# EAGLE board DMFX-1 v1.0 (EAGLE 6.3), part 1 of 3
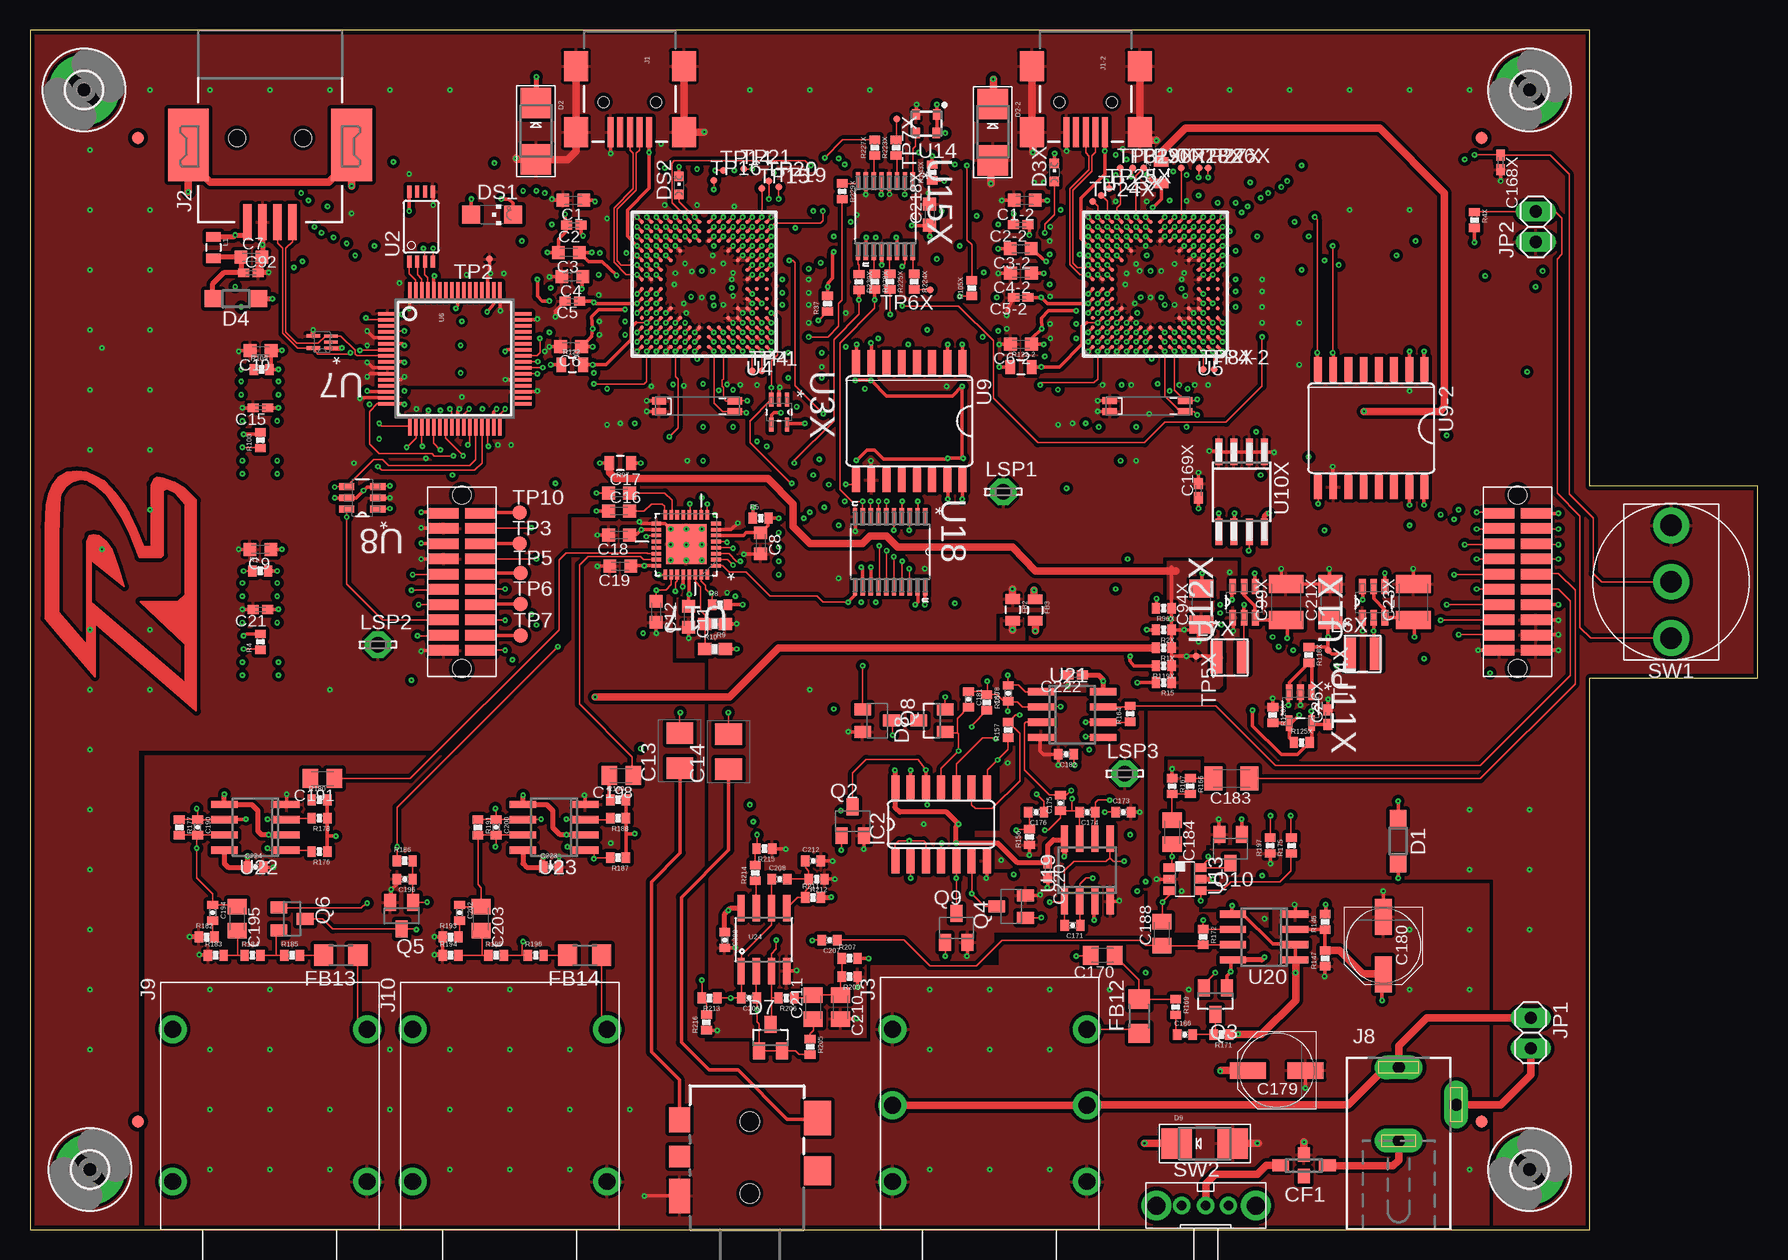
[diagram p12: board, top side]
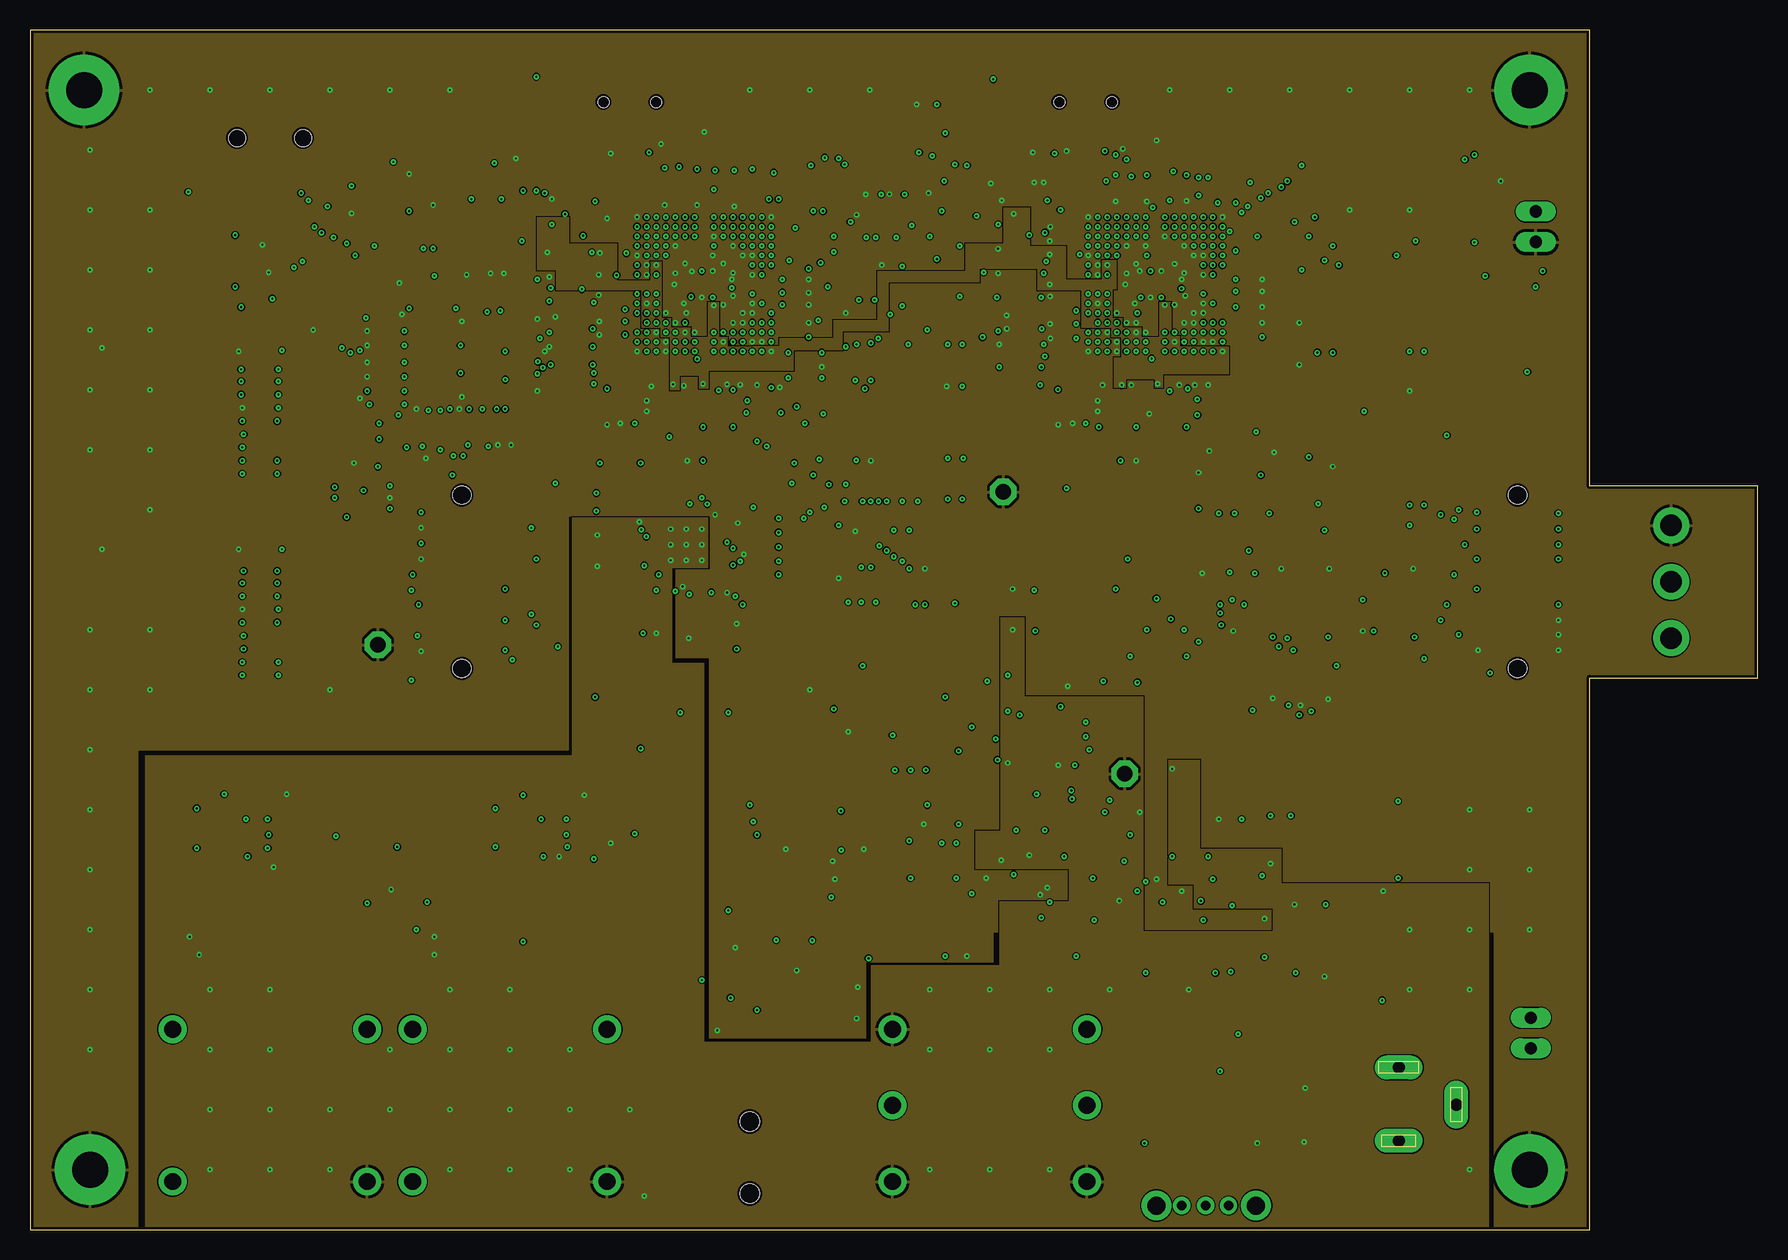
[diagram p13: board, inner layer Route2]
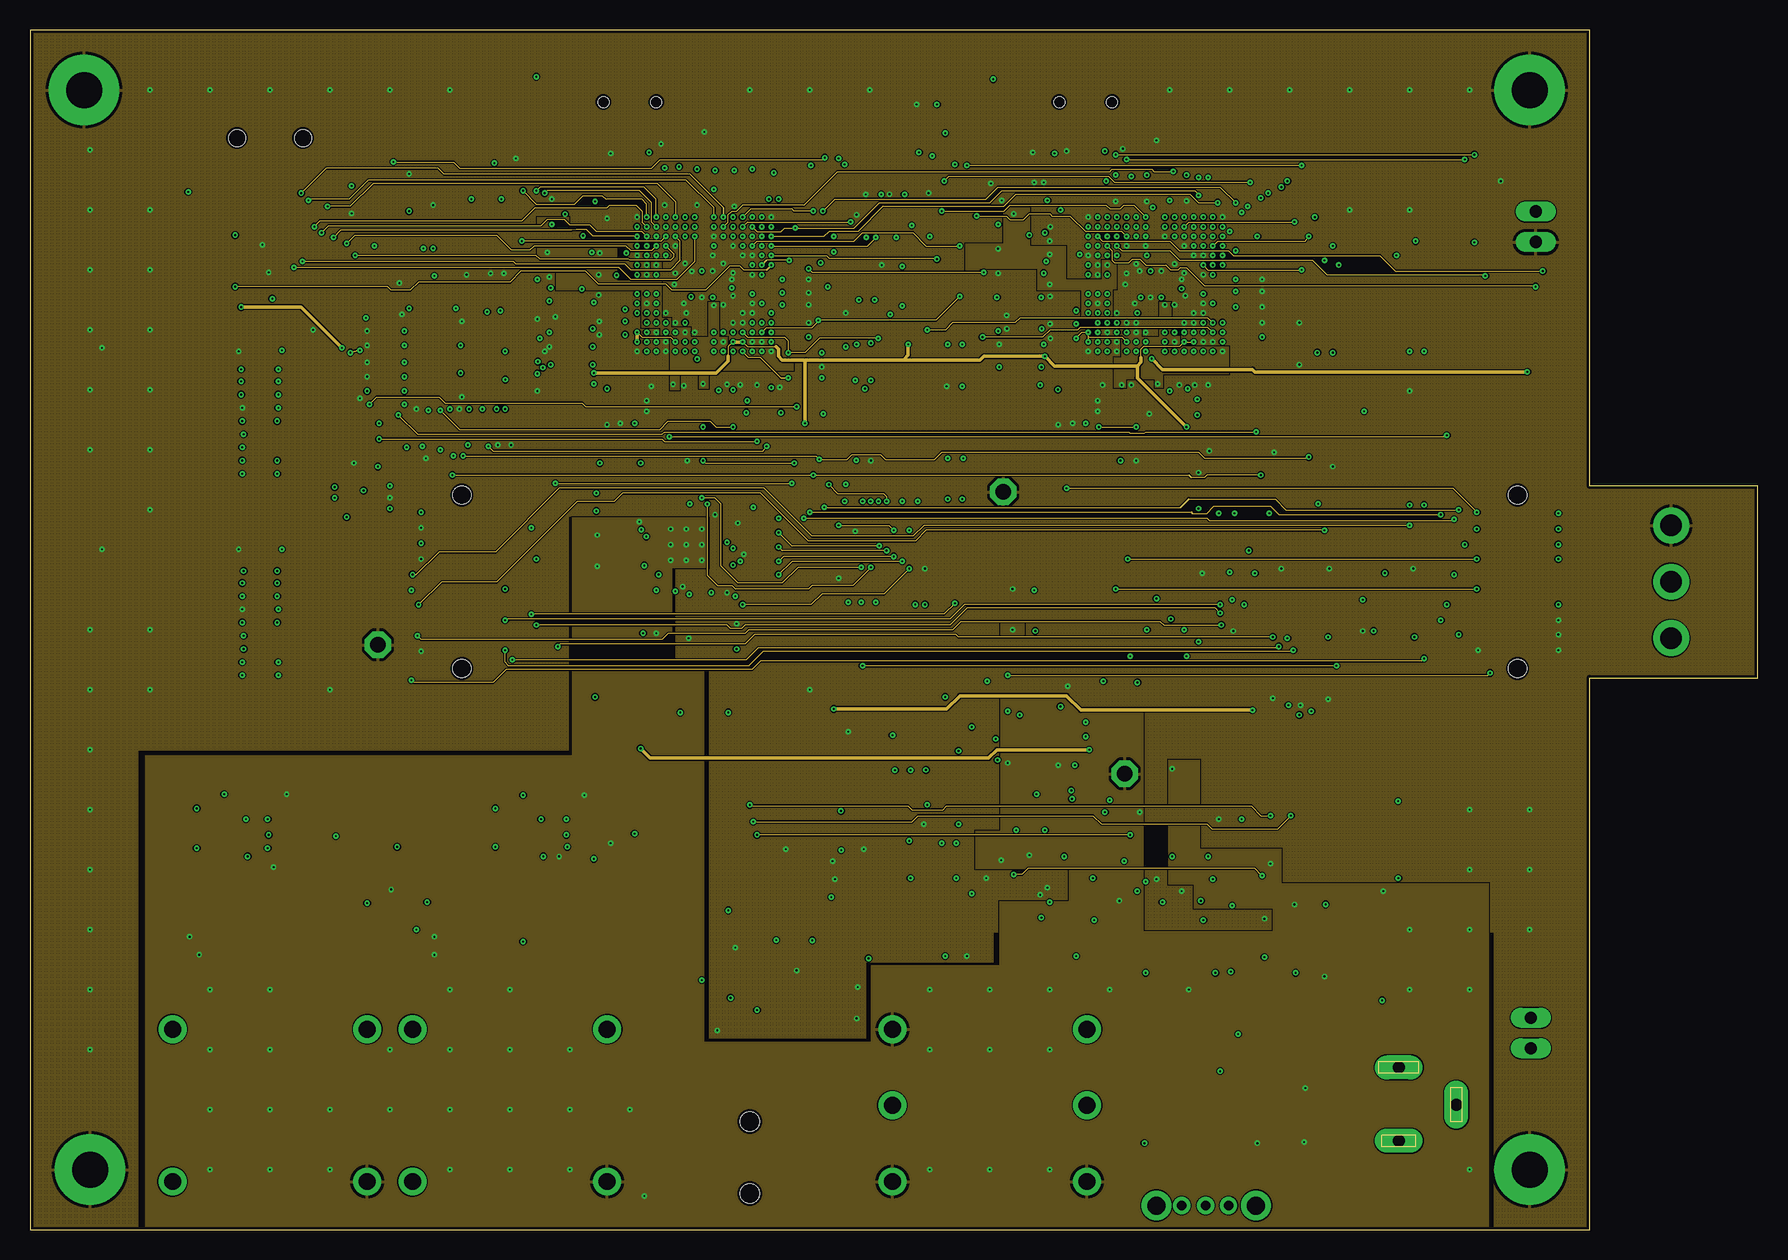
[diagram p14: board, inner layer Route3]
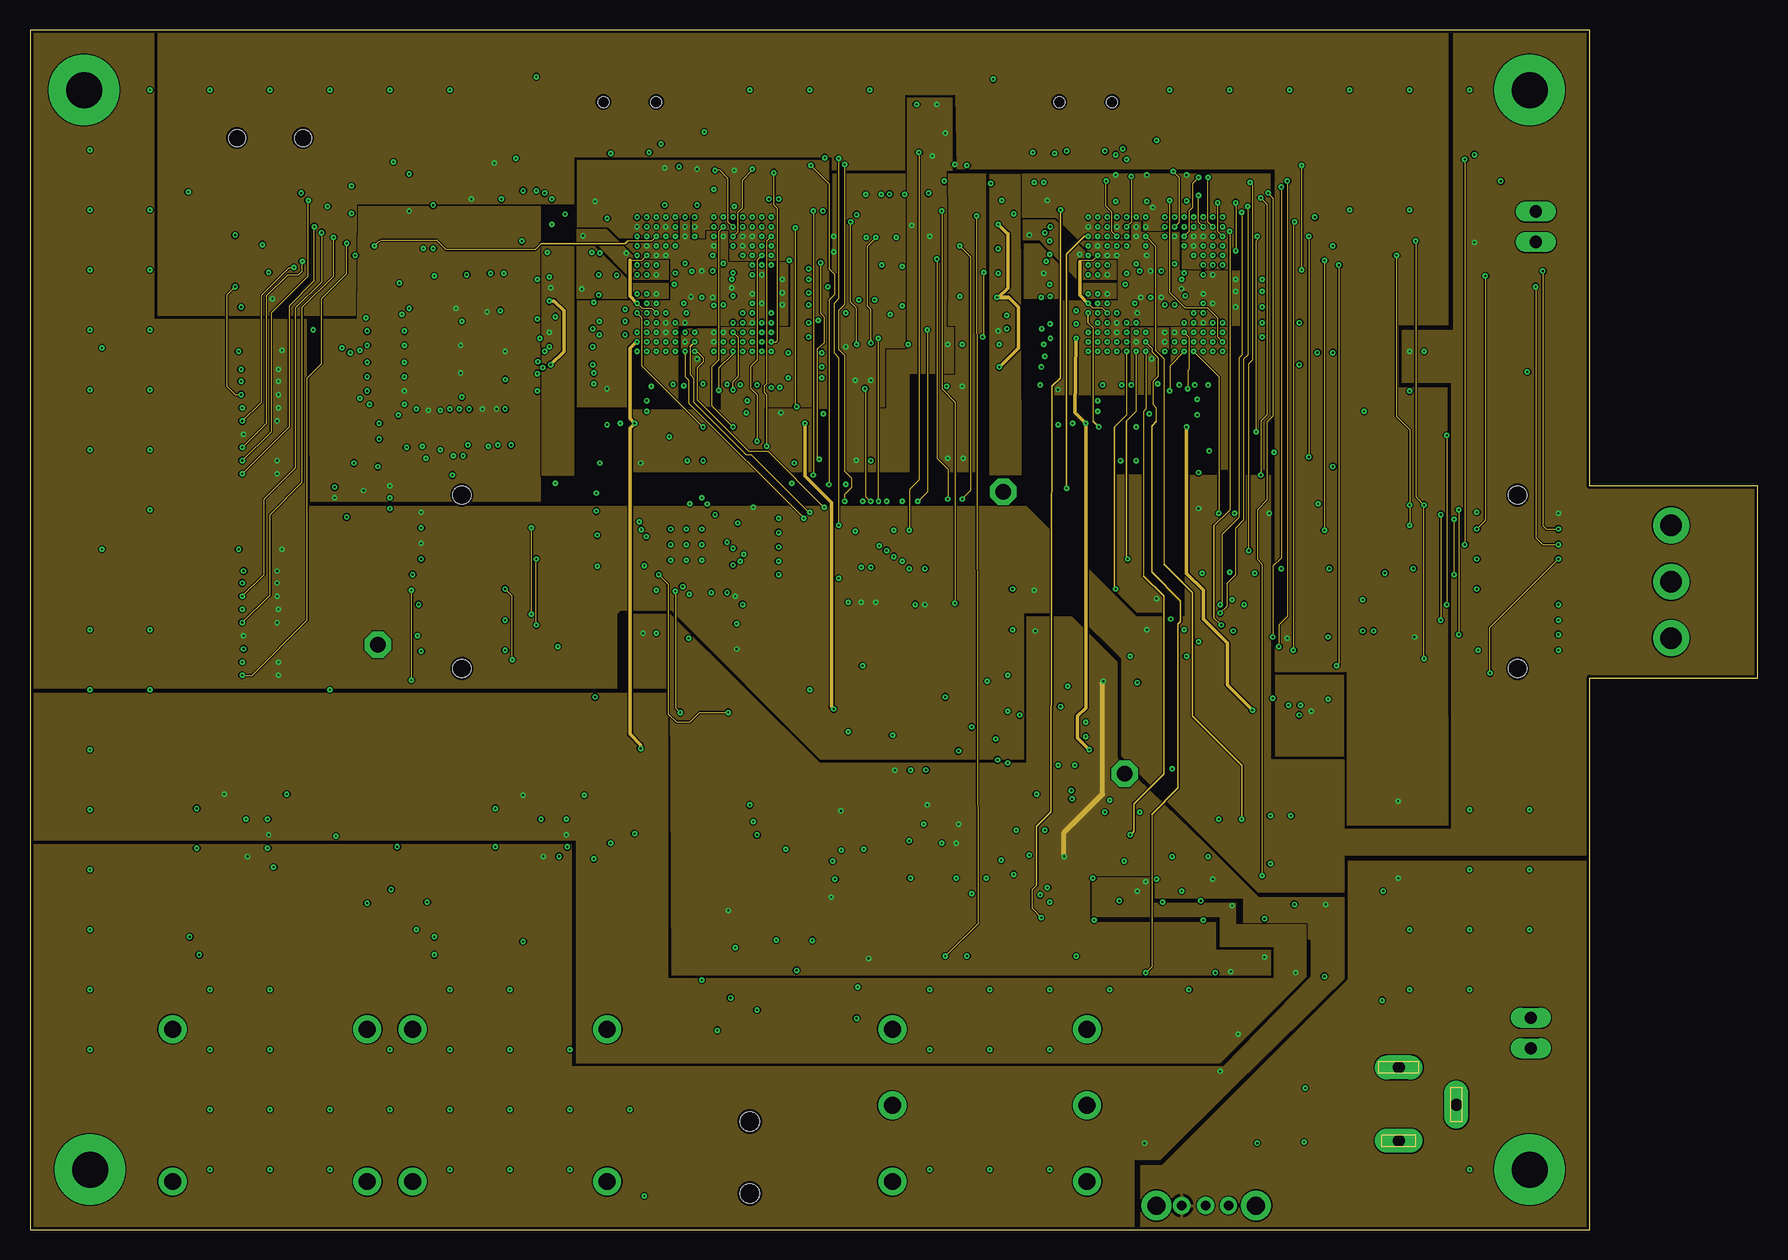
[diagram p15: board, inner layer Route4]
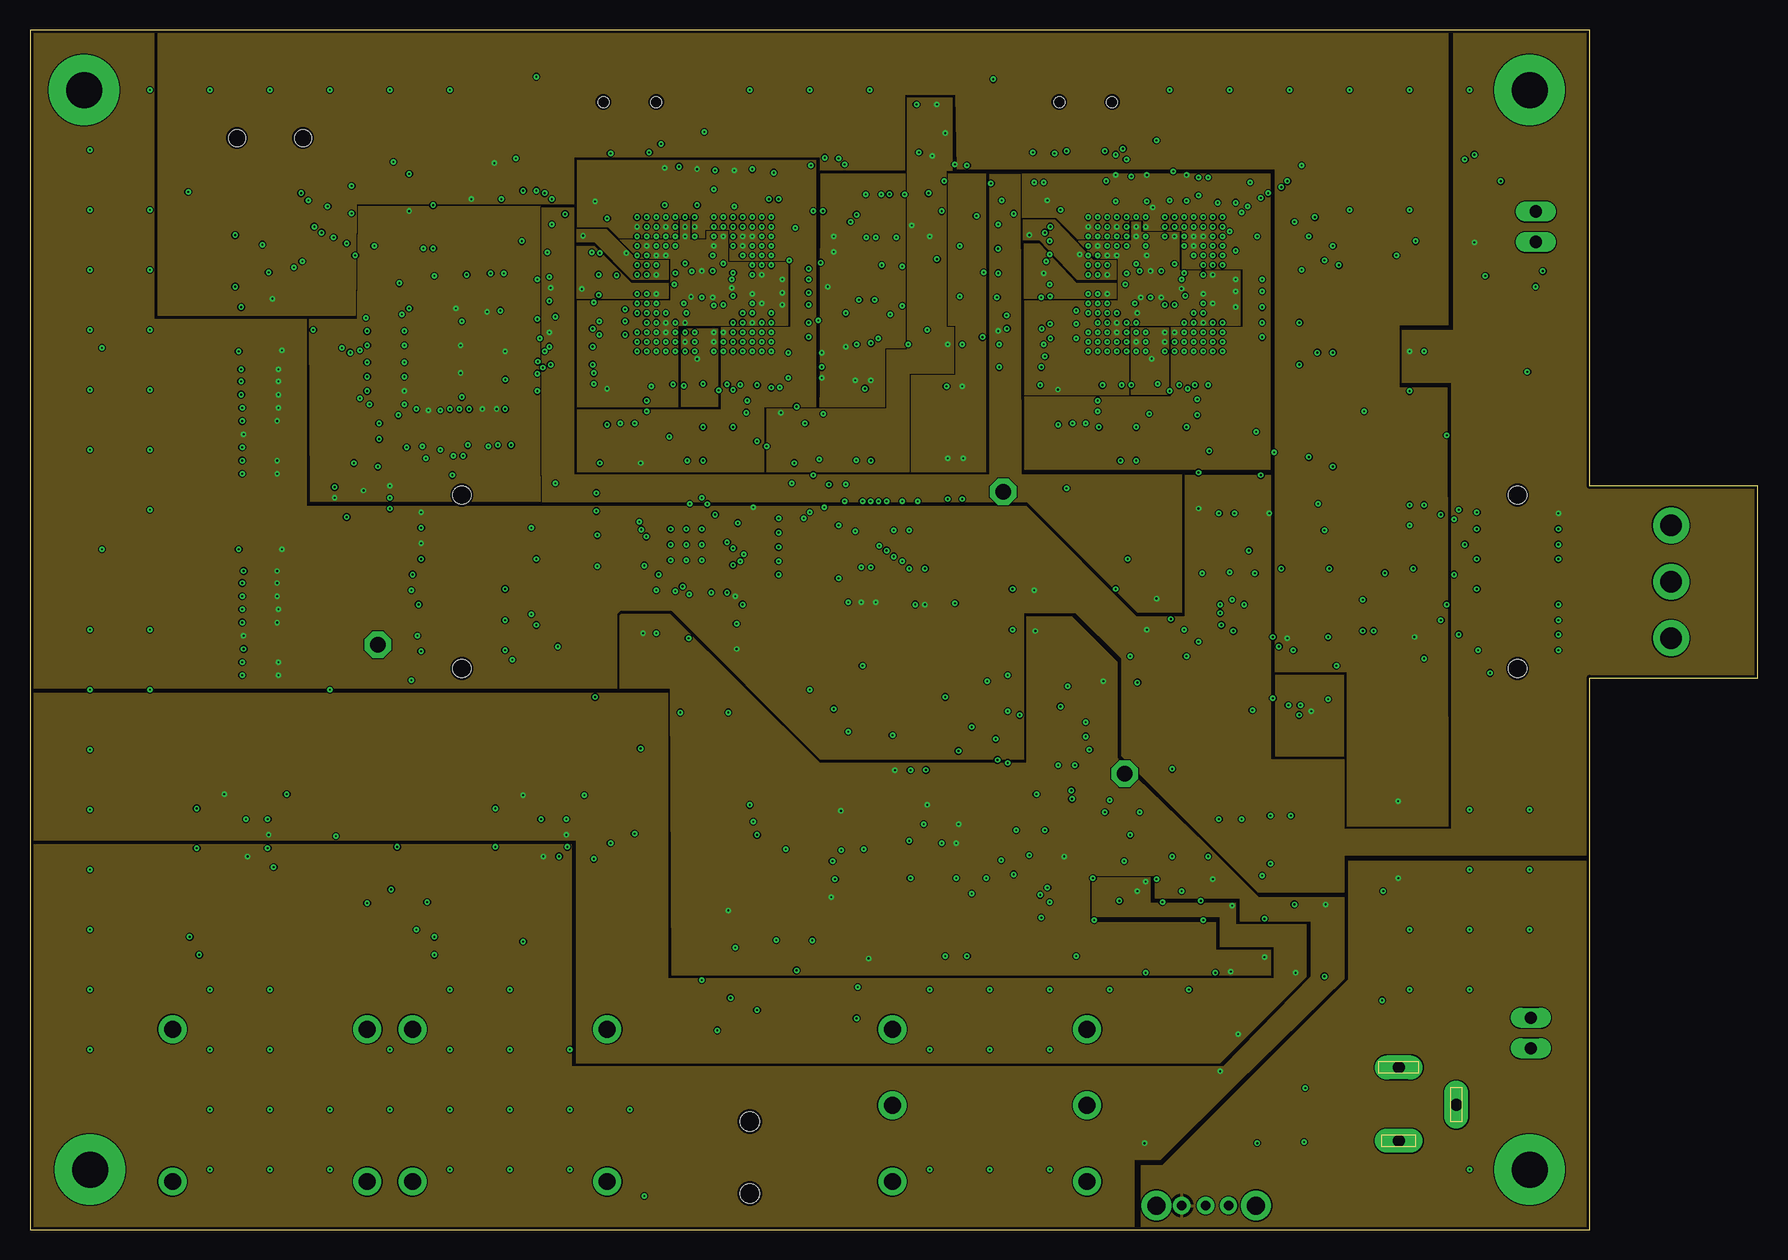
[diagram p16: board, inner layer Route5]
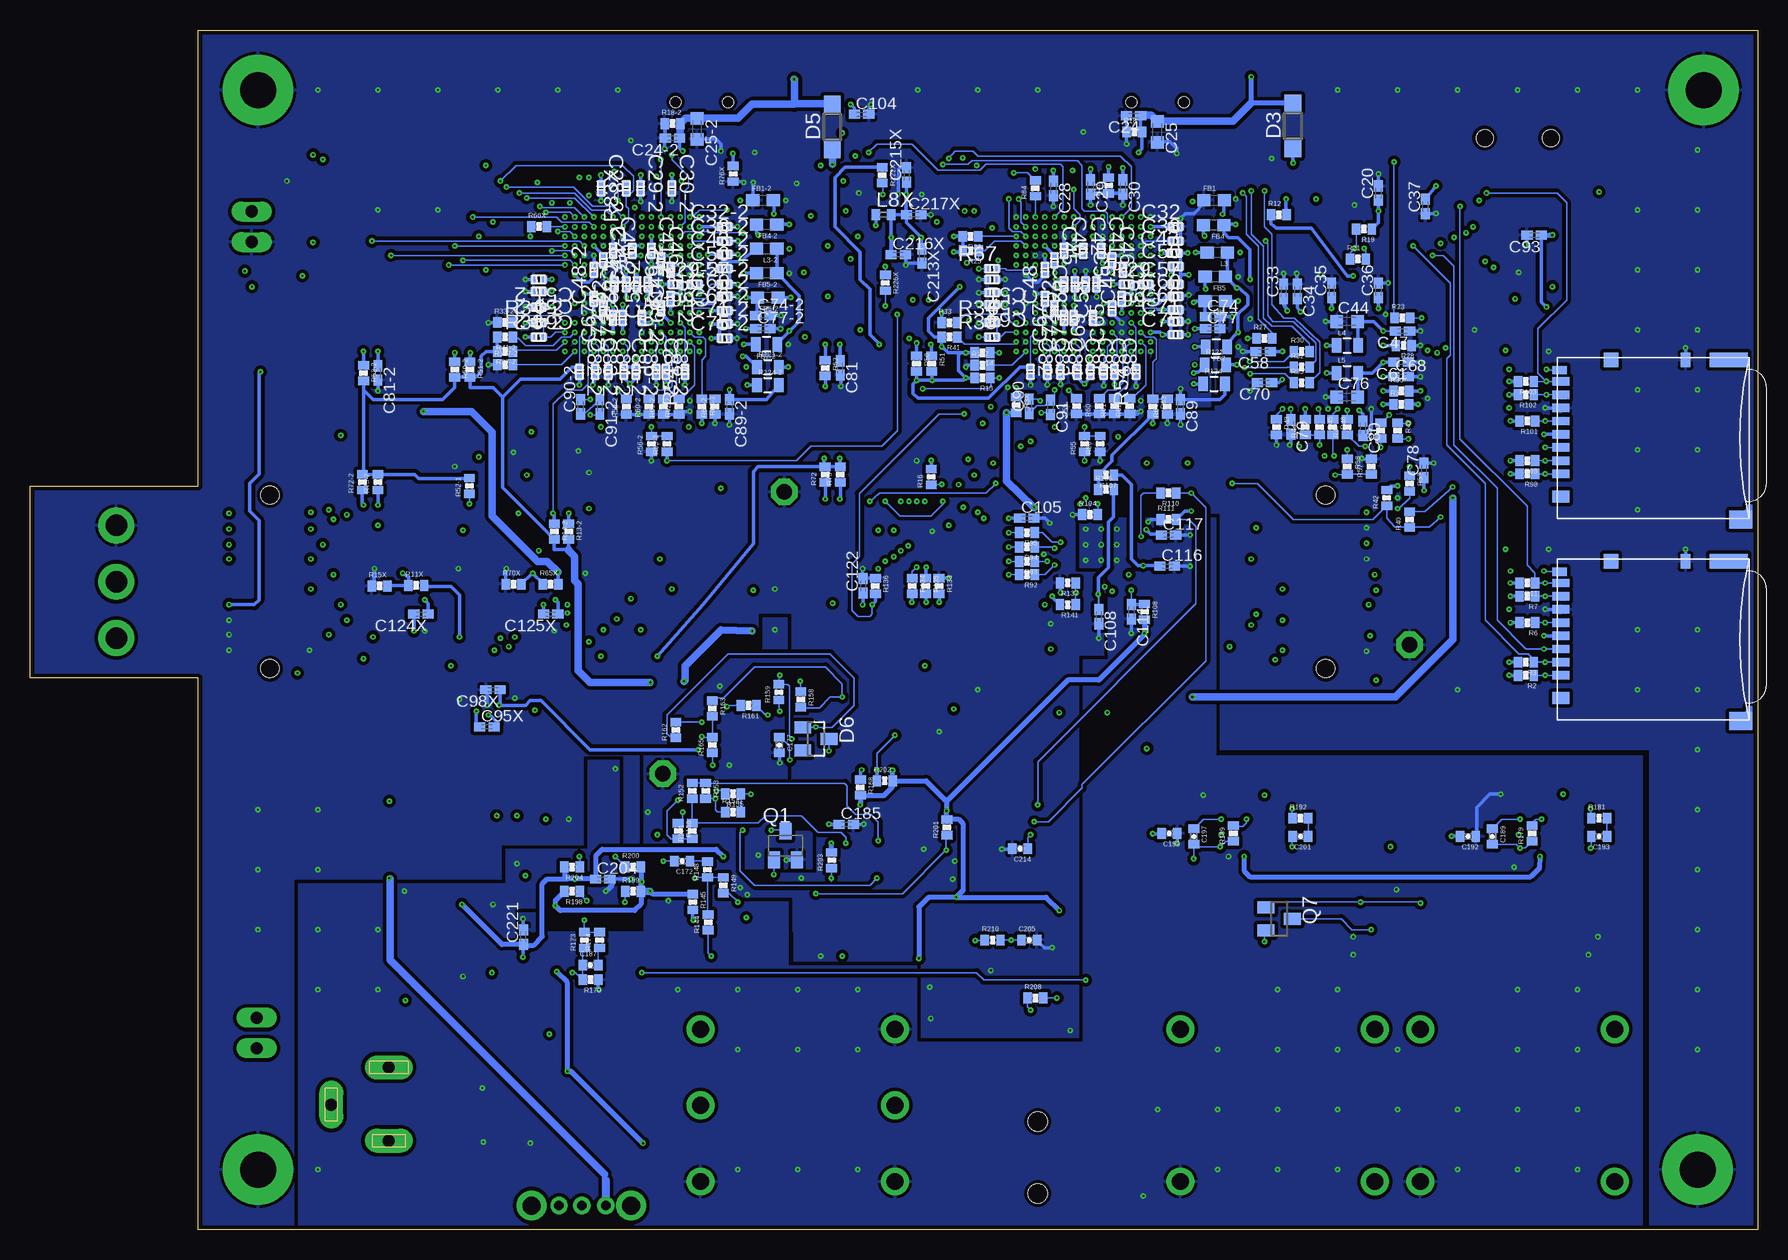
[diagram p17: board, bottom side, seen from below]

Size 144 x 100 mm. Coordinates in mm from the lower left corner, seen from the top.
Outline: 0,0 130,0 130,46 144,46 144,62 130,62 130,100 0,100 0,0
Copper layers (1*2*3*4*5*16): Top 0.035mm / dielectric 0.125mm / Route2 0.035mm / dielectric 0.125mm / Route3 0.035mm / dielectric 35mil / Route4 0.035mm / dielectric 0.125mm / Route5 0.035mm / dielectric 0.125mm / Bottom 0.035mm
Design rules "default *": minimum track width 0.1mm, minimum drill 0.15mm, track to track 0.1mm, track to pad 0.1mm, pad to pad 0.1mm, via to via 0.1mm, smd to smd 0.1mm, copper to edge 8mil, drill to drill 0.125mm, minimum pad ring 0.15mm, minimum via ring 0.15mm, stop-mask expansion 2mil, vias tented up to drill 0.15mm, thermal gap 10mil
Net classes: 0 default: width 0.1 mm; 1 POWER: width 0.305 mm; 2 USB: width 0.203 mm, drill 0.203 mm, clearance 0.406 mm to class 0, clearance 0.406 mm to class 1

## Footprints (pad centres in the part's own frame; a part is rotated, then mirrored left to right if it is on the bottom)
C0603K = smd 1.05 x 1.08: 1 -0.875,0; 2 0.875,0
C0402K = smd 0.925 x 0.74: 1 -0.6,0; 2 0.6,0
1411 = smd 1.8 x 2.23: + 1.46,0; - -1.46,0
C1206K = smd 1.5 x 2: 1 -1.5,0; 2 1.5,0
C1210K = smd 1.5 x 2.9: 1 -1.5,0; 2 1.5,0
0402 = smd 0.559 x 0.61: 1 -0.406,0; 2 0.406,0
C0805K = smd 1.3 x 1.6: 1 -1,0; 2 1,0
0402-CAP = smd 0.7 x 0.9: 1 -0.65,0; 2 0.65,0
PANASONIC_D = smd 3 x 1.4: + 2.4,0; - -2.4,0
NFM3DC = smd 1.4 x 1: 1 -1.95,0; 3 1.95,0 | smd 1 x 1.2: 2@1 0,-0.9; 2@2 0,0.9
SOD123 = smd 1.4 x 1.4: A 1.9,0; C -1.9,0
SMADIODE = smd 2.54 x 2.54: A 2.349,0; C -2.349,0
CHIPLED_0603 = smd 0.8 x 0.8: A 0,-0.75; C 0,0.75
SOT23 = smd 1 x 1.4: 1 -0.95,-1.1; 2 0.95,-1.1; 3 0,1.1
CHIPLED_1206 = smd 1.5 x 1.5: A 0,-1.75; C 0,1.75
0603 = smd 1.1 x 1: 1 -0.85,0; 2 0.85,0
0805 = smd 0.8 x 1.2: 1 -0.9,0; 2 0.9,0
R1206 = smd 1.6 x 1.803: 1 -1.422,0; 2 1.422,0
3,0-PAD = drill 3 pad 5.842: B3,0 0,0
SO14 = smd 0.66 x 2.032: 1 -3.81,-3.073; 2 -2.54,-3.073; 3 -1.27,-3.073; 4 0,-3.073; 5 1.27,-3.073; 6 2.54,-3.073; 7 3.81,-3.073; 8 3.81,3.073; 9 2.54,3.073; 10 1.27,3.073; 11 0,3.073; 12 -1.27,3.073; 13 -2.54,3.073; 14 -3.81,3.073
USB-MINIB = smd 2.5 x 0.5: D+ 2.5,0; D- 2.5,0.8; GND 2.5,-1.6; ID 2.5,-0.8; VBUS 2.5,1.6 | smd 2.5 x 2: MTN1 -3,4.5; MTN2 2.5,4.5; MTN3 -3,-4.5; MTN4 2.5,-4.5 | hole 0.9: 0,2.2; 0,-2.2
USB-B-SMT = smd 6.04 x 3.4: 5 0.58,6.8; 6 0.58,-6.8 | smd 3 x 0.7: D+ 7,1.875; D- 7,0.625; GND 7,-0.625; VUSB 7,-1.875 | hole 1.4: 0,2.75; 0,-2.75
NEUTRIK-NMJ6HCD2 = drill 1.4: R -8.115,-10.35; RN 8.115,-10.35; S -8.115,-4; SN 8.115,-4; T -8.115,-16.7; TN 8.115,-16.7
AUDIO-JACK-3.5MM-SMD = smd 2.9 x 1.75: 1 2.8,5.875 | smd 2.9 x 2.25: 2 9.3,-5.625 | smd 2.1 x 1.75: 3 9.15,5.875 | smd 2.4 x 2.25: 4 4.9,-5.625 | smd 1.8 x 1.75: 5 6.1,5.875 | hole 1.6: 3,0; 9,0
87409-110LF = smd 0.889 x 2.54: 1 5.715,1.524; 2 5.715,-1.524; 3 4.445,1.524; 4 4.445,-1.524; 5 3.175,1.524; 6 3.175,-1.524; 7 1.905,1.524; 8 1.905,-1.524; 9 0.635,1.524; 10 0.635,-1.524; 11 -0.635,1.524; 12 -0.635,-1.524; 13 -1.905,1.524; 14 -1.905,-1.524; 15 -3.175,1.524; 16 -3.175,-1.524; 17 -4.445,1.524; 18 -4.445,-1.524; 19 -5.715,1.524; 20 -5.715,-1.524 | hole 1.5: 7.239,0; -7.239,0
MICROSD_RBT = smd 0.7 x 1.4: 1 0,0.7; 2 1.1,0.7; 3 2.2,0.7; 4 3.3,0.7; 5 4.4,0.7; 6 5.5,0.7; 7 6.6,0.7; 8 7.7,0.7 | smd 0.7 x 1.2: 9 8.65,0.8 | smd 1.2 x 1.2: 10 9.5,-3.5 | smd 1.2 x 0.8: 11 9.5,-9.7 | smd 1.2 x 3.2: 12 9.5,-13.3 | smd 1.5 x 1.9: 13 -3.8,-14.3 | smd 1 x 1.4: 14 -1.9,0.7
DCJ0202 = drill 1 pad 2 long: 1 0,3.1; 2 4.8,0; 3 0,-3
NEUTRIK-NMJ4HCD2 = drill 1.4: S -8.115,-4; SN 8.115,-4; T -8.115,-16.7; TN 8.115,-16.7
1X02 = drill 1.016 long: 1 -1.27,0; 2 1.27,0
FIDUCIAL-1X2.5 = smd 1 x 1: 1 0,0
SRN3015 = smd 1 x 2.7: 1 -1.1,0; 2 1.1,0
0402' = smd 0.7 x 0.9: 1 -0.65,0; 2 0.65,0
LSP13 = drill 1.321 pad 2.159 octagon: MP 0,0
SC59-BEC = smd 1 x 1.4: B -0.95,-1.2; C 0,1.2; E 0.95,-1.2
0402-RES = smd 0.7 x 0.9: 1 -0.65,0; 2 0.65,0
0603-RES = smd 1.1 x 1: 1 -0.85,0; 2 0.85,0
MB2011 = drill 1.8: 1 0,0; 2 0,4.7; 3 0,9.4
OS102011MA1Q = drill 0.8 pad 1.422: 1 -2,0; 2 0,0; 3 1.9,0 | drill 1.5 pad 2.184: MT1 -4.1,0; MT2 4.2,0
TP06R = smd 0.6 x 0.6: TP 0,0
TP12R = smd 1.2 x 1.2: TP 0,0
SOT95P280X145-6N = smd 1.27 x 0.559: 1 -1.295,0.94; 2 -1.295,0; 3 -1.295,-0.94; 4 1.295,-0.94; 5 1.295,0; 6 1.295,0.94
TSSOP8 = smd 0.35 x 1: 1 -0.975,-2.925; 2 -0.325,-2.925; 3 0.325,-2.925; 4 0.975,-2.925; 5 0.975,2.925; 6 0.325,2.925; 7 -0.325,2.925; 8 -0.975,2.925
SOT65P210X110-5N = smd 1.168 x 0.356: 1 -1.041,0.66; 2 -1.041,0; 3 -1.041,-0.66; 4 1.041,-0.66; 5 1.041,0.66
PBGA144 = smd 0.35 x 0.35: A1 -5.2,5.2; A2 -4.4,5.2; A3 -3.6,5.2; A4 -2.8,5.2; A5 -2,5.2; A6 -1.2,5.2; A7 -0.4,5.2; A8 0.4,5.2; A9 1.2,5.2; A10 2,5.2; A11 2.8,5.2; A12 3.6,5.2; A13 4.4,5.2; A14 5.2,5.2; B1 -5.2,4.4; B2 -4.4,4.4; B3 -3.6,4.4; B4 -2.8,4.4; B5 -2,4.4; B6 -1.2,4.4; B7 -0.4,4.4; B8 0.4,4.4; B9 1.2,4.4; B10 2,4.4; B11 2.8,4.4; B12 3.6,4.4; B13 4.4,4.4; B14 5.2,4.4; C1 -5.2,3.6; C2 -4.4,3.6; C3 -3.6,3.6; C4 -2.8,3.6; C5 -2,3.6; C6 -1.2,3.6; C7 -0.4,3.6; C8 0.4,3.6; C9 1.2,3.6; C10 2,3.6; C11 2.8,3.6; C12 3.6,3.6; C13 4.4,3.6; C14 5.2,3.6; D1 -5.2,2.8; D2 -4.4,2.8; D3 -3.6,2.8; D4 -2.8,2.8; D5 -2,2.8; D10 2,2.8; D11 2.8,2.8; D12 3.6,2.8; D13 4.4,2.8; D14 5.2,2.8; E1 -5.2,2; E2 -4.4,2; E3 -3.6,2; E4 -2.8,2; E11 2.8,2; E12 3.6,2; E13 4.4,2; E14 5.2,2; F1 -5.2,1.2; F2 -4.4,1.2; F3 -3.6,1.2; F12 3.6,1.2; F13 4.4,1.2; F14 5.2,1.2; G1 -5.2,0.4; G2 -4.4,0.4; G3 -3.6,0.4; G12 3.6,0.4; G13 4.4,0.4; G14 5.2,0.4; H1 -5.2,-0.4; H2 -4.4,-0.4; H3 -3.6,-0.4; H12 3.6,-0.4; H13 4.4,-0.4; H14 5.2,-0.4; J1 -5.2,-1.2; J2 -4.4,-1.2; J3 -3.6,-1.2; J12 3.6,-1.2; J13 4.4,-1.2; J14 5.2,-1.2; K1 -5.2,-2; K2 -4.4,-2; K3 -3.6,-2; K4 -2.8,-2; K11 2.8,-2; K12 3.6,-2; K13 4.4,-2; K14 5.2,-2; L1 -5.2,-2.8; L2 -4.4,-2.8; L3 -3.6,-2.8; L4 -2.8,-2.8; L5 -2,-2.8; L10 2,-2.8; L11 2.8,-2.8; L12 3.6,-2.8; L13 4.4,-2.8; L14 5.2,-2.8; M1 -5.2,-3.6; M2 -4.4,-3.6; M3 -3.6,-3.6; M4 -2.8,-3.6; M5 -2,-3.6; M6 -1.2,-3.6; M7 -0.4,-3.6; M8 0.4,-3.6; M9 1.2,-3.6; M10 2,-3.6; M11 2.8,-3.6; M12 3.6,-3.6; M13 4.4,-3.6; M14 5.2,-3.6; N1 -5.2,-4.4; N2 -4.4,-4.4; N3 -3.6,-4.4; N4 -2.8,-4.4; N5 -2,-4.4; N6 -1.2,-4.4; N7 -0.4,-4.4; N8 0.4,-4.4; N9 1.2,-4.4; N10 2,-4.4; N11 2.8,-4.4; N12 3.6,-4.4; N13 4.4,-4.4; N14 5.2,-4.4; P1 -5.2,-5.2; P2 -4.4,-5.2; P3 -3.6,-5.2; P4 -2.8,-5.2; P5 -2,-5.2; P6 -1.2,-5.2; P7 -0.4,-5.2; P8 0.4,-5.2; P9 1.2,-5.2; P10 2,-5.2; P11 2.8,-5.2; P12 3.6,-5.2; P13 4.4,-5.2; P14 5.2,-5.2
LQFP-10X10-64 = smd 0.3 x 1.6: 1 -3.75,-5.6; 2 -3.25,-5.6; 3 -2.75,-5.6; 4 -2.25,-5.6; 5 -1.75,-5.6; 6 -1.25,-5.6; 7 -0.75,-5.6; 8 -0.25,-5.6; 9 0.25,-5.6; 10 0.75,-5.6; 11 1.25,-5.6; 12 1.75,-5.6; 13 2.25,-5.6; 14 2.75,-5.6; 15 3.25,-5.6; 16 3.75,-5.6; 33 3.75,5.6; 34 3.25,5.6; 35 2.75,5.6; 36 2.25,5.6; 37 1.75,5.6; 38 1.25,5.6; 39 0.75,5.6; 40 0.25,5.6; 41 -0.25,5.6; 42 -0.75,5.6; 43 -1.25,5.6; 44 -1.75,5.6; 45 -2.25,5.6; 46 -2.75,5.6; 47 -3.25,5.6; 48 -3.75,5.6 | smd 1.6 x 0.3: 17 5.6,-3.75; 18 5.6,-3.25; 19 5.6,-2.75; 20 5.6,-2.25; 21 5.6,-1.75; 22 5.6,-1.25; 23 5.6,-0.75; 24 5.6,-0.25; 25 5.6,0.25; 26 5.6,0.75; 27 5.6,1.25; 28 5.6,1.75; 29 5.6,2.25; 30 5.6,2.75; 31 5.6,3.25; 32 5.6,3.75; 49 -5.6,3.75; 50 -5.6,3.25; 51 -5.6,2.75; 52 -5.6,2.25; 53 -5.6,1.75; 54 -5.6,1.25; 55 -5.6,0.75; 56 -5.6,0.25; 57 -5.6,-0.25; 58 -5.6,-0.75; 59 -5.6,-1.25; 60 -5.6,-1.75; 61 -5.6,-2.25; 62 -5.6,-2.75; 63 -5.6,-3.25; 64 -5.6,-3.75
SOT50P160X60-5N = smd 1.118 x 0.254: 1 -0.737,0.508; 2 -0.737,0; 3 -0.737,-0.508 | smd 1.118 x 0.305: 4 0.737,-0.508; 5 0.737,0.508
SO16L = smd 0.66 x 2.032: 1 -4.445,-4.902; 2 -3.175,-4.902; 3 -1.905,-4.902; 4 -0.635,-4.902; 5 0.635,-4.902; 6 1.905,-4.902; 7 3.175,-4.902; 8 4.445,-4.902; 9 4.445,4.902; 10 3.175,4.902; 11 1.905,4.902; 12 0.635,4.902; 13 -0.635,4.902; 14 -1.905,4.902; 15 -3.175,4.902; 16 -4.445,4.902
SO-08M = smd 0.6 x 2.2: 1 -1.905,-3.33; 2 -0.635,-3.33; 3 0.635,-3.33; 4 1.905,-3.33; 5 1.905,3.33; 6 0.635,3.33; 7 -0.635,3.33; 8 -1.905,3.33
SOT95P280X145-5N = smd 1.27 x 0.559: 1 -1.295,0.94; 2 -1.295,0; 3 -1.295,-0.94; 4 1.295,-0.94; 5 1.295,0.94
DBV_R-PDSO-G6 = smd 0.69 x 0.99: 1 -0.95,-1.29; 2 0,-1.29; 3 0.95,-1.29; 4 0.95,1.3; 5 0,1.3; 6 -0.95,1.3
ASDM1 = smd 0.65 x 0.85: 1 -0.865,-0.775; 2 0.865,-0.775; 3 0.865,0.775; 4 -0.825,0.775
SOP65P640X120-16N = smd 1.473 x 0.356: 1 -2.921,2.286; 2 -2.921,1.626; 3 -2.921,0.965; 4 -2.921,0.33; 5 -2.921,-0.33; 6 -2.921,-0.965; 7 -2.921,-1.626; 8 -2.921,-2.286; 9 2.921,-2.286; 10 2.921,-1.626; 11 2.921,-0.965; 12 2.921,-0.33; 13 2.921,0.33; 14 2.921,0.965; 15 2.921,1.626; 16 2.921,2.286
QFN50P500X500X100-33N = smd 0.813 x 0.305: 1 -2.489,1.753; 2 -2.489,1.245; 3 -2.489,0.762; 4 -2.489,0.254; 5 -2.489,-0.254; 6 -2.489,-0.762; 7 -2.489,-1.245; 8 -2.489,-1.753; 17 2.489,-1.753; 18 2.489,-1.245; 19 2.489,-0.762; 20 2.489,-0.254; 21 2.489,0.254; 22 2.489,0.762; 23 2.489,1.245; 24 2.489,1.753 | smd 0.305 x 0.813: 9 -1.753,-2.489; 10 -1.245,-2.489; 11 -0.762,-2.489; 12 -0.254,-2.489; 13 0.254,-2.489; 14 0.762,-2.489; 15 1.245,-2.489; 16 1.753,-2.489; 25 1.753,2.489; 26 1.245,2.489; 27 0.762,2.489; 28 0.254,2.489; 29 -0.254,2.489; 30 -0.762,2.489; 31 -1.245,2.489; 32 -1.753,2.489 | smd 3.353 x 3.353: 33 0,-0.051
SOP65P640X120-20N = smd 1.473 x 0.356: 1 -2.921,2.921; 2 -2.921,2.286; 3 -2.921,1.626; 4 -2.921,0.965; 5 -2.921,0.33; 6 -2.921,-0.33; 7 -2.921,-0.965; 8 -2.921,-1.626; 9 -2.921,-2.286; 10 -2.921,-2.921; 11 2.921,-2.921; 12 2.921,-2.286; 13 2.921,-1.626; 14 2.921,-0.965; 15 2.921,-0.33; 16 2.921,0.33; 17 2.921,0.965; 18 2.921,1.626; 19 2.921,2.286; 20 2.921,2.921
SO08 = smd 0.6 x 2.2: 1 -1.905,-2.6; 2 -0.635,-2.6; 3 0.635,-2.6; 4 1.905,-2.6; 5 1.905,2.6; 6 0.635,2.6; 7 -0.635,2.6; 8 -1.905,2.6
SO08' = smd 0.61 x 2.21: 1 -1.905,-2.616; 2 -0.635,-2.616; 3 0.635,-2.616; 4 1.905,-2.616; 5 1.905,2.616; 6 0.635,2.616; 7 -0.635,2.616; 8 -1.905,2.616
CRYSTAL-32KHZ-SMD_EPSON_MC146 = smd 1.2 x 0.6: NC1 6.9,1.2; NC2 6.9,0.3; P$1 0.6,0.3; P$2 0.6,1.2

## Placement (x,y rotation side)
C1  10u  [C0603K]  45.3,85.8 180 top
C1-2  10u  [C0603K]  82.9,85.8 180 top
C2  1u  [C0402K]  45.34,83.73 180 top
C2-2  1u  [C0402K]  82.6,83.78 180 top
C3  10u  [C0603K]  44.93,81.45 180 top
C3-2  10u  [C0603K]  82.6,81.76 180 top
C4  10u  [C0603K]  45.2,79.42 180 top
C4-2  10u  [C0603K]  82.6,79.72 180 top
C5  1u  [C0402K]  45.2,77.4 180 top
C5-2  1u  [C0402K]  82.6,77.7 180 top
C6  10u  [C0603K]  45.1,73.6 180 top
C6-2  10u  [C0603K]  82.6,73.8 180 top
C7  10u  [C0603K]  18.46,81.05 0 top
C8  10u  [C0603K]  60.9,57.2 270 top
C9  10u  [C0603K]  19.2,56.7 180 top
C10  10u  [C0603K]  19.23,73.26 180 top
C11  10u  [C0603K]  54.9,51.1 270 top
C12  10u  [C0603K]  52.2,51.5 270 top
C13  100u  [1411]  54.16,39.92 90 top
C14  100u  [1411]  58.24,39.82 90 top
C15  0.1u  [C0402K]  19.2,68.5 180 top
C16  0.47u  [C0603K]  49.1,59.9 0 top
C17  0.47u  [C0603K]  49.1,61.4 0 top
C18  10u  [C0603K]  49.1,57.9 180 top
C19  10u  [C0603K]  49.2,55.3 180 top
C20  0.1u  [C0402K]  31.6,86.4 90 bottom
C21  0.1u  [C0402K]  19.2,51.7 180 top
C21X  22u  [C1206K]  108.4,52.3 90 top
C23X  22u  [C1210K]  115.3,52.3 90 top
C24  0.1u  [C0402K]  52.02,92.86 180 bottom
C24-2  0.1u  [C0402K]  90.44,90.97 180 bottom
C25  10u  [C0603K]  50.04,91.5 270 bottom
C25-2  10u  [C0603K]  88.39,91.76 270 bottom
C26X  1u  [C0402K]  108.2,42.7 90 top
C28  0.1u  [C0402K]  58.7,86.8 270 bottom
C28-2  0.1u  [0402]  96.4,86.8 270 bottom
C29  0.1u  [C0402K]  55.6,86.9 270 bottom
C29-2  0.1u  [0402]  93.1,86.8 270 bottom
C30  0.1u  [C0402K]  52.9,86.9 270 bottom
C30-2  0.1u  [0402]  90.5,86.8 270 bottom
C32  0.1u  [0402]  48.5,83.6 0 bottom
C32-2  0.1u  [0402]  86.1,83.6 0 bottom
C33  10n  [C0402K]  39.5,78.2 90 bottom
C34  0.1u  [C0402K]  38.35,78.2 270 bottom
C35  0.1u  [C0402K]  35.5,78.3 90 bottom
C36  0.1u  [C0402K]  31.6,78.3 90 bottom
C37  10n  [C0402K]  27.69,85.28 90 bottom
C38  10n  [0402]  48.5,82.4 0 bottom
C38-2  10n  [0402]  86.1,82.4 0 bottom
C40  0.1u  [0402]  57.8,81.6 270 bottom
C40-2  0.1u  [0402]  95.4,81.6 270 bottom
C41  10n  [0402]  54.7,81.6 270 bottom
C41-2  10n  [0402]  92.2,81.6 270 bottom
C42  1u  [0402]  56.2,81.6 270 bottom
C42-2  1u  [0402]  93.8,81.6 90 bottom
C43  10n  [0402]  48.6,81.4 0 bottom
C43-2  10n  [0402]  86.1,81.3 0 bottom
C44  4.7u  [C0603K]  34.2,75.7 0 bottom
C45  0.1u  [0402]  58.6,80.8 270 bottom
C45-2  0.1u  [0402]  96.2,80.8 270 bottom
C46  0.1u  [0402]  53.8,80.8 270 bottom
C46-2  0.1u  [0402]  91.4,80.8 270 bottom
C47  0.1u  [C0402K]  29.6,74.9 180 bottom
C48  0.1u  [0402]  59.4,80 90 bottom
C48-2  0.1u  [0402]  97,80 90 bottom
C49  0.1u  [0402]  52.9,80 90 bottom
C49-2  0.1u  [0402]  90.6,80 90 bottom
C50  1n  [0402]  48.5,80.3 0 bottom
C50-2  1n  [0402]  86.1,80.1 0 bottom
C51  10n  [0402]  63.8,79.2 180 bottom
C51-2  10n  [0402]  101.6,79.2 180 bottom
C52  1u  [0402]  57.8,78.8 90 bottom
C52-2  1u  [0402]  95.3,78.8 90 bottom
C53  1u  [0402]  56.9,78.8 90 bottom
C53-2  1u  [0402]  94.3,78.8 90 bottom
C54  1u  [0402]  56,78.8 270 bottom
C54-2  1u  [0402]  93.4,78.8 270 bottom
C55  10n  [0402]  55.1,78.8 90 bottom
C55-2  10n  [0402]  92.5,78.8 90 bottom
C56  1n  [0402]  52.6,78.8 180 bottom
C56-2  1n  [0402]  90.2,78.8 180 bottom
C57  0.1u  [0402]  48.5,78.8 0 bottom
C57-2  0.1u  [0402]  86.1,78.8 0 bottom
C58  10n  [C0402K]  41.2,73.2 180 bottom
C59  0.1u  [0402]  63.8,78.1 180 bottom
C59-2  0.1u  [0402]  101.6,78.2 180 bottom
C60  0.1u  [0402]  48.5,77.8 0 bottom
C60-2  0.1u  [0402]  86.1,77.8 0 bottom
C61  0.1u  [C0402K]  29.7,72.3 180 bottom
C62  0.1u  [0402]  59.4,77.6 270 bottom
C62-2  0.1u  [0402]  97,77.6 270 bottom
C63  0.1u  [0402]  53,77.6 270 bottom
C63-2  0.1u  [0402]  90.6,77.6 270 bottom
C64  1u  [0402]  63.8,77.1 180 bottom
C64-2  1u  [0402]  101.6,76.9 180 bottom
C65  0.1u  [0402]  53.8,76.8 90 bottom
C65-2  0.1u  [0402]  91.4,76.8 90 bottom
C66  1n  [0402]  48.51,76.67 0 bottom
C66-2  1n  [0402]  86.1,76.6 0 bottom
C67  0.1u  [0402]  58.6,76.8 90 bottom
C67-2  0.1u  [0402]  96.2,76.8 90 bottom
C68  0.1u  [C0402K]  29.7,71.1 0 bottom
C69  0.1u  [0402]  55.4,76 90 bottom
C69-2  0.1u  [0402]  93,76 270 bottom
C70  0.1u  [C0402K]  41.1,70.6 180 bottom
C71  0.1u  [0402]  48.5,75.7 0 bottom
C71-2  0.1u  [0402]  86.1,75.5 0 bottom
C72  0.1u  [0402]  57.8,76 90 bottom
C72-2  0.1u  [0402]  95.4,76 90 bottom
C73  10n  [0402]  57,76 90 bottom
C73-2  10n  [0402]  94.6,76 90 bottom
C74  1n  [C0402K]  45.4,76.1 0 bottom
C74-2  1n  [C0402K]  82.9,76.2 0 bottom
C75  0.1u  [0402]  48.5,74.6 0 bottom
C75-2  0.1u  [0402]  86.1,74.3 0 bottom
C76  4.7u  [C0603K]  34.2,69.4 0 bottom
C77  0.1u  [C0402K]  45.4,75.1 0 bottom
C77-2  0.1u  [C0402K]  82.9,75.1 0 bottom
C78  0.1u  [C0402K]  27.8,63.3 90 bottom
C79  0.1u  [C0402K]  38.9,66.9 270 bottom
C80  0.1u  [C0402K]  32.9,66.8 270 bottom
C81  0.1u  [C0402K]  76.45,71.82 270 bottom
C81-2  0.1u  [C0402K]  115,71.4 270 bottom
C82  0.1u  [0402]  60.6,71.5 270 bottom
C82-2  0.1u  [0402]  98.2,71.5 270 bottom
C83  1u  [0402]  59.2,71.5 270 bottom
C83-2  1u  [0402]  96.9,71.5 270 bottom
C84  0.1u  [0402]  58.1,71.5 270 bottom
C84-2  0.1u  [0402]  95.8,71.5 270 bottom
C85  0.1u  [0402]  56.7,71.5 270 bottom
C85-2  0.1u  [0402]  94.5,71.5 270 bottom
C86  1u  [0402]  55.6,71.5 270 bottom
C86-2  1u  [0402]  93.5,71.5 270 bottom
C87  0.1u  [0402]  54.5,71.5 270 bottom
C87-2  0.1u  [0402]  91.8,71.5 270 bottom
C88  0.1u  [0402]  53.6,71.5 270 bottom
C88-2  0.1u  [0402]  91,71.5 270 bottom
C89  10n  [C0402K]  48.1,68.6 270 bottom
C89-2  10n  [C0402K]  85.7,68.6 270 bottom
C90  10p  [C0402K]  60.71,68.64 90 bottom
C90-2  10p  [C0402K]  98.1,68.6 90 bottom
C91  10p  [C0402K]  58.93,68.54 270 bottom
C91-2  10p  [C0402K]  96.5,68.6 270 bottom
C92  0.1u  [C0402K]  18.41,79.75 0 top
C93  10n  [C0402K]  18.61,82.89 180 bottom
C94X  22u  [C1206K]  97.66,51.94 90 top
C95X  820p  [C0402K]  105.92,41.91 0 bottom
C98X  0.1u  [C0402K]  105.4,45 180 bottom
C99X  22u  [C1210K]  104.7,52.3 90 top
C104  10n  [C0402K]  74.68,92.96 0 bottom
C105  0.1u  [C0402K]  60.9,59.3 0 bottom
C108  0.1u  [C0402K]  54.9,51.1 270 bottom
C111  0.1u  [C0402K]  52.2,51.5 270 bottom
C116  0.1u  [C0402K]  49.2,55.3 0 bottom
C117  0.1u  [C0402K]  49.1,57.9 0 bottom
C122  0.1u  [C0402K]  74.55,53.66 90 bottom
C124X  0.1u  [C0402K]  111.4,51.3 180 bottom
C125X  0.1u  [C0402K]  100.6,51.3 180 bottom
C168X  100p  [C0402K]  122.58,88.96 270 top
C169X  0.1u  [C0402K]  97.4,61.6 90 top
C170  10u  [C0805K]  89.41,22.86 180 top
C171  22p  [0402-CAP]  86.91,25.36 180 top
C172  8.2n  [0402-CAP]  89.63,30.72 180 bottom
C173  1u  [0402-CAP]  91.14,34.8 0 top
C174  100p  [0402-CAP]  88.14,34.8 180 top
C175  33n  [0402-CAP]  85.91,35.56 90 top
C176  220n  [0402-CAP]  83.87,34.8 180 top
C177  1u  [0402-CAP]  81.53,40.39 270 bottom
C178  47p  [0402-CAP]  81.53,44.7 90 top
C179  100u  [PANASONIC_D]  103.92,13.26 180 top
C180  100u  [PANASONIC_D]  112.81,23.66 270 top
C181  100p  [0402-CAP]  78.23,44.2 270 top
C182  2.2u  [0402-CAP]  86.36,39.62 180 top
C183  22u  [C1206K]  100.16,37.6 180 top
C184  10u  [C0805K]  95.2,33.12 270 top
C185  0.1u  [C0402K]  75.95,33.78 0 bottom
C186  47n  [0402-CAP]  96.27,16.26 0 top
C187  2.2n  [0402-CAP]  97.28,22.05 0 bottom
C188  10u  [C0805K]  94.34,24.66 90 top
C189  220p  [0402-CAP]  22.1,32.77 270 bottom
C190  22p  [0402-CAP]  13.97,33.53 270 top
C191  10u  [C0805K]  24.38,37.59 180 top
C192  2.2n  [0402-CAP]  24.13,32.77 180 bottom
C193  2.2n  [0402-CAP]  13.21,32.77 180 bottom
C194  150p  [0402-CAP]  15.24,26.42 270 top
C195  10u  [C0805K]  17.27,25.91 270 top
C196  2.2n  [0402-CAP]  31.24,29.21 180 top
C197  220p  [0402-CAP]  46.99,32.77 270 bottom
C198  10u  [C0805K]  49.28,37.85 180 top
C199  2.2n  [0402-CAP]  49.02,33.02 180 bottom
C200  22p  [0402-CAP]  38.86,33.53 270 top
C201  2.2n  [0402-CAP]  38.1,32.77 180 bottom
C202  150p  [0402-CAP]  35.81,26.42 270 top
C203  10u  [C0805K]  37.59,25.91 270 top
C204  0.1u  [C0402K]  96.27,29.21 0 bottom
C205  100p  [0402-CAP]  60.71,24.13 0 bottom
C206  220p  [0402-CAP]  59.94,19.3 180 top
C207  10n  [0402-CAP]  66.65,24.13 180 top
C208  18n  [0402-CAP]  62.48,29.21 0 top
C209  0.1u  [0402-CAP]  57.91,24.13 270 top
C210  10u  [C0805K]  67.56,18.54 270 top
C211  10u  [C0805K]  65.28,18.54 90 top
C212  680p  [0402-CAP]  65.28,30.73 0 top
C213X  0.1u  [C0402K]  69.65,81.15 270 bottom
C214  100p  [0402-CAP]  61.47,31.75 180 bottom
C215X  0.1u  [C0402K]  70.92,87.91 90 bottom
C216X  0.1u  [C0402K]  71.63,81.28 0 bottom
C217X  1u  [C0402K]  70.32,84.61 0 bottom
C218X  10u  [C0603K]  74.99,84.61 90 top
C220  0.1u  [C0402K]  84.84,29.97 270 top
C221  0.1u  [C0402K]  102.87,24.38 90 bottom
C222  0.1u  [C0402K]  87.12,46.23 180 top
C223  0.1u  [0402-CAP]  43.43,30.23 0 top
C224  0.1u  [0402-CAP]  18.8,30.23 0 top
CF1  NFM3DPC223R1H3L  [NFM3DC]  106.2,5.35 180 top
D1  MBR0520LT  [SOD123]  114.05,32.38 270 top
D2  6.2V  [SMADIODE]  42.18,91.58 270 top
D2-2  6.2V  [SMADIODE]  80.26,91.49 270 top
D3  MBR0520LT  [SOD123]  38.73,92.01 90 bottom
D3X  GREEN  [CHIPLED_0603]  85.39,88.13 0 top
D4  MBR0520LT  [SOD123]  17.18,77.59 180 top
D5  MBR0520LT  [SOD123]  77.12,91.92 90 bottom
D6  BAT54  [SOT23]  78.49,40.89 270 bottom
D7  BAT54S  [SOT23]  61.72,16 0 top
D8  BAT54S  [SOT23]  75.18,42.42 90 top
D9  S1G-13-F  [SMADIODE]  97.92,7.17 0 top
DS1  GREEN  [CHIPLED_1206]  38.5,84.6 270 top
DS2  GREEN  [CHIPLED_0603]  54.09,87.04 0 top
FB1  BLM18AG601SN1D  [0603]  45.3,85.8 0 bottom
FB1-2  BLM18AG601SN1D  [0603]  82.9,85.8 0 bottom
FB2  BLM21AG151SN1D  [0805]  81.92,51.66 270 top
FB3  BLM21AG151SN1D  [0805]  83.78,51.63 270 top
FB4  BLM18AG601SN1D  [0603]  45.34,83.73 180 bottom
FB4-2  BLM18AG601SN1D  [0603]  82.6,83.78 180 bottom
FB5  BLM18AG601SN1D  [0603]  45.2,79.42 180 bottom
FB5-2  BLM18AG601SN1D  [0603]  82.6,79.72 180 bottom
FB6  BLM18AG601SN1D  [0603]  45.2,77.4 180 bottom
FB6-2  BLM18AG601SN1D  [0603]  82.5,77.7 180 bottom
FB7  BLM18AG601SN1D  [0805]  45.1,73.6 180 bottom
FB7-2  BLM18AG601SN1D  [0805]  82.6,73.8 180 bottom
FB12  BLM31PG121SN1L  [R1206]  92.46,17.78 90 top
FB13  BLM31PG121SN1L  [R1206]  25.91,22.86 180 top
FB14  BLM31PG121SN1L  [R1206]  46.23,22.86 180 top
H1  MOUNT-PAD-ROUND3.0  [3,0-PAD]  5,5 0 top
H2  MOUNT-PAD-ROUND3.0  [3,0-PAD]  4.5,95 0 top
H3  MOUNT-PAD-ROUND3.0  [3,0-PAD]  125,95 0 top
H4  MOUNT-PAD-ROUND3.0  [3,0-PAD]  125,5 0 top
IC2  SN74HC4066D  [SO14]  75.95,33.78 0 top
J1  USB-MINIB-5PIN  [USB-MINIB]  50,94 270 top
J1-2  USB-MINIB-5PIN  [USB-MINIB]  88,94 270 top
J2  USB-B-SMT  [USB-B-SMT]  20,91 270 top
J3  STEREOSW3C  [NEUTRIK-NMJ6HCD2]  80,0 180 top
J4  HEADPHONES  [AUDIO-JACK-3.5MM-SMD]  60,0 90 top
J5  87409-110LF  [87409-110LF]  36,54 90 top
J6  DM3BT-DSF-PEJS  [MICROSD_RBT]  15.7,63 90 bottom
J7  87409-110LF  [87409-110LF]  124,54 90 top
J8  DCJ0202  [DCJ0202]  114.09,10.41 0 top
J9  MONOSW3C  [NEUTRIK-NMJ4HCD2]  20,0 180 top
J10  MONOSW3C  [NEUTRIK-NMJ4HCD2]  40,0 180 top
J11  DM3BT-DSF-PEJS  [MICROSD_RBT]  15.7,46.2 90 bottom
JP1  BAT  [1X02]  125.09,16.38 270 top
JP2  FOOTSW  [1X02]  125.52,83.6 90 top
JP3  FIDUCIAL1X2.5  [FIDUCIAL-1X2.5]  9,9 0 top
JP6  FIDUCIAL1X2.5  [FIDUCIAL-1X2.5]  9,91 0 top
JP7  FIDUCIAL1X2.5  [FIDUCIAL-1X2.5]  121,9 0 top
JP8  FIDUCIAL1X2.5  [FIDUCIAL-1X2.5]  121,91 0 top
L1  BLM21PG221SN1  [0805]  15.29,81.86 270 top
L3  BLM18AG601SN1D  [0603]  45.03,81.45 180 bottom
L3-2  BLM18AG601SN1D  [0603]  82.6,81.76 180 bottom
L4  BLM21PG21SN1  [0805]  34.2,73.7 0 bottom
L5  BLM21PG221SN1  [0805]  34.2,71.4 0 bottom
L6X  2.2u  [SRN3015]  111.1,48 0 top
L7X  3.3u  [SRN3015]  100,47.7 0 top
L8X  BML15HD601SN1  [0402']  72.86,84.61 0 bottom
LSP1  LSP13  [LSP13]  81.12,61.5 0 top
LSP2  LSP13  [LSP13]  29,48.75 0 top
LSP3  LSP13  [LSP13]  91.25,38 0 top
Q1  MUN2214T1  [SC59-BEC]  81.03,32 0 bottom
Q2  MUN2214T1  [SC59-BEC]  68.58,34.04 0 top
Q3  MMBF4393  [SOT23]  98.81,19.05 180 top
Q4  MUN2214T1  [SC59-BEC]  81.79,26.92 90 top
Q5  2N7002ET1G  [SOT23]  30.99,26.16 180 top
Q6  2N7002ET1G  [SOT23]  21.84,25.91 270 top
Q7  2N7002ET1G  [SOT23]  39.88,25.91 270 bottom
Q8  MUN2214T1  [SC59-BEC]  70.61,42.42 270 top
Q9  MUN2214T1  [SC59-BEC]  77.22,25.15 0 top
Q10  MUN2214T1  [SC59-BEC]  100.08,31.75 180 top
R1  10k  [0402-RES]  19.2,54.9 0 top
R1X  0  [0402-RES]  94.5,48.5 180 top
R2  10k  [0402-RES]  19.3,46.2 180 bottom
R2X  0  [0402-RES]  94.5,50 180 top
R3  10k  [0402-RES]  19.3,47.3 180 bottom
R3X  10k  [0402-RES]  61.78,68.74 270 bottom
R4  10k  [0402-RES]  19.2,49 90 top
R4X  10k  [0402-RES]  120.4,84.16 270 top
R5  0  [0402-RES]  60.91,59.31 0 top
R6  NC  [0402-RES]  19.2,50.6 180 bottom
R7  10k  [0402-RES]  19.2,52.8 180 bottom
R8  0  [0402-RES]  57.51,52.08 0 top
R9  NC  [0603-RES]  57.1,50.5 180 top
R10  4.7k  [0603-RES]  57.1,48.4 0 top
R11  10k  [0402-RES]  19.2,53.9 180 bottom
R11X  13.7k  [0402-RES]  111.8,53.7 0 bottom
R12  560  [0402-RES]  39.9,84.6 0 bottom
R13  10k  [0402-RES]  64.6,71 180 bottom
R13-2  10k  [0402-RES]  99.1,58.2 270 bottom
R14  10k  [0402-RES]  64.6,73.1 180 bottom
R14-2  10k  [0402-RES]  100.3,58.2 270 bottom
R15  0  [0402-RES]  94.5,45.6 180 top
R15X  10k  [0402-RES]  114.86,53.65 0 bottom
R16  10k  [0402-RES]  68.88,62.75 90 bottom
R17  220  [0402-RES]  54.09,87.04 90 bottom
R18  100k  [0402-RES]  51.94,91.5 0 bottom
R18-2  100k  [0402-RES]  90.44,92.2 0 bottom
R19  10k  [0402-RES]  32.8,83.4 180 bottom
R21  2.2k  [0402-RES]  33.3,80.9 0 bottom
R22  10k  [0402-RES]  65.6,82.8 180 bottom
R23  0  [0402-RES]  29.6,76 0 bottom
R25  10k  [0402-RES]  65.58,81.6 180 bottom
R27  0  [0402-RES]  41.1,74.3 0 bottom
R28  12k  [0402-RES]  29.5,73.7 180 bottom
R29  10k  [0402]  51,78.8 0 bottom
R29-2  10k  [0402]  88.6,78.8 0 bottom
R30  0  [0402-RES]  38,73.2 0 bottom
R32  0  [0402-RES]  38,71.9 0 bottom
R33  10k  [0402-RES]  67.36,75.6 0 bottom
R33-2  10k  [0402-RES]  104.39,75.62 0 bottom
R34  NC  [0402]  63.8,75.6 0 bottom
R34-2  NC  [0402]  101.6,75.6 0 bottom
R35  0  [0402-RES]  38,70.6 0 bottom
R36  10k  [0402-RES]  29.7,69.9 0 bottom
R37  100k  [0402-RES]  66.48,77.18 90 top
R37-2  100k  [0402-RES]  104.4,73.2 180 bottom
R38  0  [0402]  63.8,74.4 0 bottom
R38-2  0  [0402]  101.6,74.4 0 bottom
R39  33  [0402-RES]  29.7,68.8 0 bottom
R40  NC  [0402-RES]  29,59.2 90 bottom
R41  100k  [0402-RES]  67.36,74.4 180 bottom
R41-2  100k  [0402-RES]  104.4,74.4 180 bottom
R42  10k  [0402-RES]  30.9,61 90 bottom
R43  10k  [0402-RES]  40.1,66.9 270 bottom
R44  10k  [0402-RES]  37.7,66.9 90 bottom
R45  NC  [0402-RES]  36.5,66.9 270 bottom
R46  33  [0402-RES]  35.4,66.9 270 bottom
R47  33  [0402-RES]  34.2,66.9 90 bottom
R48  33  [0402-RES]  31.4,66.6 90 bottom
R49  33  [0402-RES]  30,66.6 270 bottom
R50  10k  [0402-RES]  70.1,72.2 270 bottom
R50-2  10k  [0402-RES]  108.6,71.7 270 bottom
R51  10k  [0402-RES]  68.83,72.2 270 bottom
R51-2  10k  [0402-RES]  107.33,71.7 270 bottom
R52  10k  [0402-RES]  77.72,71.82 270 bottom
R52-1  10k  [0402-RES]  107.38,62 90 bottom
R52-2  10k  [0402-RES]  116.2,71.4 270 bottom
R53  33  [0402-RES]  29,62.2 270 bottom
R54  0  [0402]  51.8,71.5 90 bottom
R54-2  0  [0402]  89.4,71.5 90 bottom
R55  0  [0402-RES]  56.1,65.5 90 bottom
R55-2  0  [0402-RES]  90.9,65.5 90 bottom
R56  NC  [0402-RES]  54.8,65.5 90 bottom
R56-2  NC  [0402-RES]  92.2,65.5 90 bottom
R57  4.7k  [0402-RES]  32.2,63.6 90 bottom
R58  33  [0402-RES]  34.2,63.6 270 bottom
R59  10k  [0402-RES]  56.77,68.64 90 bottom
R59-2  10k  [0402-RES]  94.3,68.6 90 bottom
R60  0  [0402-RES]  54.86,68.64 90 bottom
R60-2  0  [0402-RES]  92.4,68.6 90 bottom
R61  0  [0402-RES]  53.59,68.64 90 bottom
R61-2  0  [0402-RES]  91.2,68.6 90 bottom
R62  NC  [0402-RES]  52.32,68.64 90 bottom
R62-2  NC  [0402-RES]  89.9,68.6 90 bottom
R63  NC  [0402-RES]  50.4,68.6 270 bottom
R63-2  NC  [0402-RES]  88,68.6 270 bottom
R64  0  [0402-RES]  49.2,68.6 90 bottom
R64-2  0  [0402-RES]  86.9,68.6 90 bottom
R65X  33.2k  [0402-RES]  100.6,53.8 0 bottom
R66X  33  [0402-RES]  101.57,83.61 0 bottom
R67  0  [0402]  63.8,80.1 0 bottom
R70X  10k  [0402-RES]  103.7,53.8 0 bottom
R72  NC  [0402-RES]  77.72,62.93 90 bottom
R72-2  NC  [0402-RES]  116.3,62.3 90 bottom
R73  NC  [0402-RES]  76.45,62.93 90 bottom
R73-2  NC  [0402-RES]  115,62.3 90 bottom
R76X  220  [0402-RES]  85.39,88 90 bottom
R83X  0  [0402]  94.3,86.8 90 bottom
R84  0  [0402-RES]  60.2,86.8 90 bottom
R92  0  [0402-RES]  60.9,54.6 180 bottom
R93  0  [0402-RES]  60.9,55.7 180 bottom
R94  0  [0402-RES]  60.9,56.9 180 bottom
R95  0  [0402-RES]  60.9,58.1 180 bottom
R96X  0  [0402-RES]  94.5,51.8 180 top
R97  0  [0805]  49.2,63.9 180 top
R97-2  0  [0805]  94.3,88.1 90 top
R98  10k  [0402-RES]  19.2,63 180 bottom
R99  10k  [0402-RES]  19.2,64.1 180 bottom
R100  10k  [0402-RES]  19.2,65.8 90 top
R101  NC  [0402-RES]  19.2,67.4 180 bottom
R102  10k  [0402-RES]  19.3,69.6 180 bottom
R103  10k  [0402-RES]  19.3,70.7 180 bottom
R104  4.7k  [0402-RES]  55.66,59.6 0 bottom
R105X  0  [0402-RES]  78.5,78.48 90 top
R106  NC  [0402-RES]  54.3,61.7 0 bottom
R107  NC  [0402-RES]  54.3,62.9 180 bottom
R108  0  [0402-RES]  51.1,51.5 270 bottom
R109  10k  [0402-RES]  19.3,71.7 0 top
R110  1k  [0402-RES]  49.1,61.4 180 bottom
R111  1k  [0402-RES]  49.1,59.2 0 bottom
R117  10k  [0402-RES]  64.6,72.05 0 bottom
R117-2  10k  [0402-RES]  104.4,72.1 0 bottom
R118X  0  [0402-RES]  106.6,47.9 270 top
R119X  0  [0402-RES]  94.5,47 180 top
R121  NC  [0805]  45.2,72.1 0 bottom
R121-2  NC  [0805]  82.5,71.9 0 bottom
R122  0  [0805]  45.2,72.1 0 top
R122-2  0  [0805]  82.6,71.9 0 top
R124  0  [0805]  45.3,70.5 0 bottom
R124-2  0  [0805]  82.5,70.4 0 bottom
R125X  20.5k  [0402-RES]  106,40.6 0 top
R126X  243k  [0402-RES]  103.6,42.9 270 top
R134  10k  [0402-RES]  70.46,53.66 270 bottom
R135  10k  [0402-RES]  69.34,53.66 270 bottom
R136  4.7k  [0402-RES]  73.53,53.66 270 bottom
R137  220k  [0402-RES]  57.5,53.9 180 bottom
R138  10k  [0402-RES]  68.22,53.66 270 bottom
R141  NC  [0402-RES]  57.5,52.1 180 bottom
R143X  10k  [0402-RES]  75.2,88.12 90 top
R144  10k  [0402-RES]  87.48,25.6 90 bottom
R145  10k  [0402-RES]  88.75,27.3 270 bottom
R146  100k  [0402-RES]  107.95,25.65 90 top
R147  100k  [0402-RES]  107.95,22.61 90 top
R148  2.2k  [0402-RES]  87.53,30 90 bottom
R149  10k  [0402-RES]  86.21,28.7 270 bottom
R150  2.2k  [0402-RES]  89.97,33.22 270 bottom
R151  33k  [0402-RES]  88.8,33.22 90 bottom
R152  180k  [0402-RES]  88.8,36.58 90 bottom
R153  56k  [0402-RES]  87.68,36.58 270 bottom
R154  4.7k  [0402-RES]  85.4,34.8 0 bottom
R155  4.7k  [0402-RES]  85.4,36.32 180 bottom
R156  1M  [0402-RES]  83.31,32.72 90 top
R157  10k  [0402-RES]  81.53,41.66 90 top
R158  1k  [0402-RES]  79.76,44.2 270 bottom
R159  47k  [0402-RES]  81.58,44.8 90 bottom
R160  1k  [0402-RES]  79.76,43.94 270 top
R161  4.7k  [0402-RES]  84.11,43.69 180 bottom
R162  4.7k  [0402-RES]  90.17,41.66 90 bottom
R163  1k  [0402-RES]  87.12,43.43 270 bottom
R164  180k  [0402-RES]  91.7,43 90 top
R165  180k  [0402-RES]  87.12,40.39 90 bottom
R166  470  [0402-RES]  96.72,36.96 270 top
R167  560  [0402-RES]  95.2,36.96 270 top
R168  100k  [0402-RES]  74.78,36.85 270 bottom
R169  10k  [0402-RES]  95.5,18.54 270 top
R170  10k  [0402-RES]  97.28,20.83 180 bottom
R171  1M  [0402-RES]  99.31,16.26 180 top
R172  18k  [0402-RES]  97.79,24.38 270 top
R173  47k  [0402-RES]  97.79,24.13 90 bottom
R174  10k  [0402-RES]  96.52,24.13 90 bottom
R175  470  [0402-RES]  105.16,32 90 top
R176  12k  [0402-RES]  24.13,31.5 180 top
R177  47k  [0402-RES]  12.45,33.53 270 top
R178  12k  [0402-RES]  24.13,34.29 180 top
R179  8.2k  [0402-RES]  18.8,33.02 90 bottom
R180  12k  [0402-RES]  24.13,35.81 0 top
R181  10k  [0402-RES]  13.21,34.29 0 bottom
R182  330  [0402-RES]  14.73,24.38 0 top
R183  100k  [0402-RES]  15.49,22.86 0 top
R184  1k  [0402-RES]  18.54,22.86 0 top
R185  1k  [0402-RES]  21.84,22.86 0 top
R186  10k  [0402-RES]  31.24,30.73 0 top
R187  12k  [0402-RES]  49.02,31 180 top
R188  12k  [0402-RES]  49.02,34.29 180 top
R189  8.2k  [0402-RES]  43.69,33.02 90 bottom
R190  12k  [0402-RES]  49.02,35.81 0 top
R191  47k  [0402-RES]  37.34,33.53 270 top
R192  10k  [0402-RES]  38.1,34.29 0 bottom
R193  330  [0402-RES]  35.05,24.38 0 top
R194  100k  [0402-RES]  35.06,22.86 0 top
R195  1k  [0402-RES]  38.86,22.86 0 top
R196  1k  [0402-RES]  42.16,22.86 0 top
R197  0  [0402-RES]  103.38,32 90 top
R198  100k  [0402-RES]  98.81,28.19 180 bottom
R199  100k  [0402-RES]  93.73,28.19 0 bottom
R200  100k  [0402-RES]  93.73,30.23 0 bottom
R201  100k  [0402-RES]  67.56,33.53 90 bottom
R202  100k  [0402-RES]  72.75,37.41 0 bottom
R203  100k  [0402-RES]  77.18,30.79 90 bottom
R204  100k  [0402-RES]  98.81,30.23 180 bottom
R205  100  [0402-RES]  65.02,15.24 270 top
R206  220k  [0402-RES]  63.04,19.3 180 top
R207  22k  [0402-RES]  68.33,22.61 0 top
R208  680k  [0402-RES]  60.2,19.3 0 bottom
R209  22k  [0402-RES]  68.33,21.08 180 top
R210  10k  [0402-RES]  63.75,24.13 0 bottom
R211  15k  [0402-RES]  65.28,27.69 0 top
R212  12k  [0402-RES]  65.58,29.21 180 top
R213  2k  [0402-RES]  56.64,19.3 180 top
R214  2k  [0402-RES]  60.45,29.72 90 top
R215  1.3k  [0402-RES]  61.21,31.75 180 top
R216  1.3k  [0402-RES]  56.39,17.27 90 top
R222X  10k  [0402-RES]  72.95,87.91 270 bottom
R223X  10  [0402-RES]  72.19,90.19 90 top
R224X  10  [0402-RES]  73.72,79.02 270 top
R225X  10  [0402-RES]  71.68,79.02 270 top
R226X  10  [0402-RES]  72.7,78.92 270 bottom
R227X  10  [0402-RES]  70.41,90.19 90 top
R228X  10  [0402-RES]  70.41,79.02 270 top
R229X  10  [0402-RES]  67.71,86.54 270 top
R230X  10  [0402-RES]  69.1,79 270 top
SW1  MB2011SB1W03-DA  [MB2011]  136.8,49.3 0 top
SW2  OS102011MA1Q  [OS102011MA1Q]  98,2 0 top
TP1  TPTP06R  [TP06R]  60.99,71.59 0 top
TP2  TPTP06R  [TP06R]  38.3,80.9 180 top
TP3  TPTP12R  [TP12R]  40.8,57.2 0 top
TP4  TPTP06R  [TP06R]  60.2,71.6 0 top
TP4-2  TPTP06R  [TP06R]  98.7,71.7 0 top
TP4X  TPTP06R  [TP06R]  108.2,48.3 270 top
TP5  TPTP12R  [TP12R]  40.88,54.72 0 top
TP5X  TPTP06R  [TP06R]  97.2,47.8 270 top
TP6  TPTP12R  [TP12R]  40.88,52.16 0 top
TP6X  TPTP06R  [TP06R]  75.04,78.34 180 top
TP7  TPTP12R  [TP12R]  40.88,49.52 0 top
TP7X  TPTP06R  [TP06R]  72.24,92.57 270 top
TP8X  TPTP06R  [TP06R]  97.8,71.7 0 top
TP10  TPTP12R  [TP12R]  40.8,59.76 0 top
TP14  TPTP06R  [TP06R]  57.8,88.3 0 top
TP15  TPTP06R  [TP06R]  61,86.8 0 top
TP16  TPTP06R  [TP06R]  57.01,87.48 0 top
TP19  TPTP06R  [TP06R]  62.4,86.9 0 top
TP20  TPTP06R  [TP06R]  61.6,87.4 0 top
TP21  TPTP06R  [TP06R]  59.5,88.4 0 top
TP23X  TPTP06R  [TP06R]  89.31,86.22 0 top
TP24X  TPTP06R  [TP06R]  88.6,85.72 0 top
TP25X  TPTP06R  [TP06R]  89.97,86.79 0 top
TP26X  TPTP06R  [TP06R]  98.2,88.5 0 top
TP27X  TPTP06R  [TP06R]  97.44,88.49 0 top
TP28X  TPTP06R  [TP06R]  95.97,88.49 0 top
TP29X  TPTP06R  [TP06R]  91.91,88.49 0 top
TP30X  TPTP06R  [TP06R]  92.82,88.49 0 top
TP31X  TPTP06R  [TP06R]  90.89,88.49 0 top
U1X  TPS562209SO  [SOT95P280X145-6N]  112,52.3 90 top
U2  AT93C46A-10TQ-2.7  [TSSOP8]  32.6,83.6 0 top
U3X  TPS3803-01DCKR  [SOT65P210X110-5N]  62.45,68.14 270 top
U4  TMS320C5535  [PBGA144]  56.2,78.8 180 top
U5  TMS320C5535  [PBGA144]  93.8,78.8 180 top
U6  FT2232HL  [LQFP-10X10-64]  35.4,72.6 270 top
U7  TPD2E001IDRLRQ1  [SOT50P160X60-5N]  24.35,73.99 180 top
U8  74LVC1G175DBVSOT95  [SOT95P280X145-6N]  27.7,61 180 top
U9  W25Q64FVSFIG  [SO16L]  73.3,67.4 180 top
U9-2  W25Q64FVSFIG  [SO16L]  111.8,66.8 180 top
U10X  24C64SM  [SO-08M]  101,61.5 180 top
U11X  TPS73201DBVT  [SOT95P280X145-5N]  105.9,43.5 270 top
U12X  TPS562209SO  [SOT95P280X145-6N]  101.2,52.3 90 top
U13  741G3157DBVR  [DBV_R-PDSO-G6]  96.27,29.21 270 top
U14  ASDM1-12.000MHZ-LC-T  [ASDM1]  74.72,92.19 180 top
U15X  CDCLVC1108PWR  [SOP65P640X120-16N]  71.3,84.48 270 top
U17  TLV320AIC3204IRHBT  [QFN50P500X500X100-33N]  54.7,57.1 180 top
U18  SN74CBTLV3245APW  [SOP65P640X120-20N]  71.7,56.5 270 top
U19  LME49721  [SO08]  88.14,29.97 0 top
U20  LME49721  [SO08]  102.87,24.38 90 top
U21  LME49721  [SO08]  86.87,42.93 270 top
U22  LME49721  [SO08]  18.8,33.53 90 top
U23  LME49721  [SO08]  43.69,33.53 90 top
U24  LMV358  [SO08']  61.17,24.17 0 top
U$172  [REZZLOGO]  10.1,54.4 90 top
Y1  32.768kHz  [CRYSTAL-32KHZ-SMD_EPSON_MC146]  59.33,69.38 180 top
Y1-2  32.768kHz  [CRYSTAL-32KHZ-SMD_EPSON_MC146]  96.9,69.4 180 top

## Tracks (layer width: path | path; a pad name or v marks a point on that pad's centre or on a via)
A-CENTER
  Top 0.305: J5.10 37.61,54.72 TP5.TP
A-DOWN
  Top 0.305: J5.6 37.55,57.2 TP3.TP
A-LEFT
  Top 0.305: J5.18 37.56,49.52 TP7.TP
A-RIGHT
  Top 0.305: J5.2 37.57,59.76 TP10.TP
A-UP
  Top 0.305: J5.14 37.59,52.16 TP6.TP
AGND  (via drill 0.15 pad 0.45)
  Top 0.305: U5.J12 v89.8,80.4 | U5.F13 v89,77.2 | U5.C9 v92.2,74.8 | U5.B6 v95.4,74 | U5.A1 v99.4,73.2 | U4.J12 v52.2,80.4 | U4.F13 v51.4,77.2 | U4.C9 v54.6,74.8 | U4.B6 v57.8,74 | U4.A1 v61.8,73.2 | C3-2.2 v80.7,81.76 | C2.2 44.62,83.73 | 44.62,83.73 v44.6,84.65 | C2-2.2 v82,84.68 | v43.12,81.45 C3.2 44.05,82.55 44.7,83.2 44.7,83.65 44.62,83.73
  Bottom 0.305: C73.2 v57,77.05 | C49.2 v52.21,80.41 v52.2,80.4 | C85.2 56.7,71 v56.1,70.5 v56.1,70.49 C86.2 | C49-2.2 v89.81,80.41 v89.8,80.4 | C73-2.2 v94.6,77.1 | C86-2.2 93.5,71 v94,70.5 94.5,71 C85-2.2 | C88-2.2 v91,70.4 | C43-2.2 v85,81.3 | v44.6,84.65 44.5,84.75 FB1.2 | v47.5,81.4 C43.2 48.1,81.31 48.1,81 C50.2 48.09,79.44 | C88.2 v53.6,70.46 | v82,84.68 82,84.8 82,85.8 FB1-2.2 | C50-2.2 C57-2.2 v85,78.8 | C57.2 48.09,79.44 | 48.09,79.44 48.1,79.59 v47.4,79.6
  pour Route2 (isolate 0.1, rank 3): 42.3,84.4 44.9,84.4 44.9,82.2 48.9,82.2 48.9,79.1 51.79,79.1 51.79,80.7 52.61,80.7 52.61,76 53.4,76 53.4,75.2 55,75.2 55,74.4 56.58,74.4 56.58,77.3 57.41,77.3 57.41,74.4 58.1,74.4 58.1,73.6 62.5,73.7 62.5,74.3 67,74.3 67,75.8 70.7,75.8 70.7,79.9 78,79.9 78,82.2 81.2,82.2 81.2,85.2 83.3,85.2 83.3,82 86.3,82 86.3,79.2 89.4,79.2 89.4,80.8 90.5,80.8 90.5,78.4 90.2,78.4 90.2,76 91,76 91,75.2 92.6,75.2 92.6,74.4 94.2,74.4 94.2,77.3 95.1,77.3 95.1,74.5 95.8,74.5 95.8,73.6 99.9,73.6 99.9,71.3 94.4,71.3 94.4,70.2 93.8,70.2 93.8,70.9 91.3,70.9 91.3,70.2 90.4,70.2 90.4,72.7 91,72.7 91,74.4 90.2,74.4 90.2,75.2 87.7,75.2 87.7,78.3 84,78.3 84,80.1 79.1,80.1 79.1,79 71.5,79 71.5,74.9 67.7,74.9 67.7,73.3 63.6,73.3 63.6,71.6 56.5,71.6 56.5,70.1 55.8,70.1 55.8,71.2 54.1,71.2 54.1,70 53.4,70 53.4,74.4 52.6,74.4 52.6,75.2 51,75.2 51,78.3 43.9,78.3 43.9,80 42.3,80
  pour Route3 (isolate 0.1, rank 3): 42.3,84.4 44.9,84.4 44.9,82.2 48.9,82.2 48.9,79.1 51.8,79.1 51.8,80.7 52.6,80.7 52.6,76 53.4,76 53.4,75.2 55,75.2 55,74.4 56.59,74.4 56.59,77.3 57.41,77.31 57.41,74.41 58.1,74.4 58.1,73.6 62.4,73.6 62.4,74.2 67,74.2 67,75.8 70.7,75.8 70.7,79.9 78,79.9 78,82.2 81.2,82.2 81.2,85.2 83.3,85.2 83.3,82 86.3,82 86.3,79.2 89.4,79.2 89.4,80.8 90.5,80.8 90.5,78.4 90.2,78.4 90.2,76 91,76 91,75.2 92.6,75.2 92.6,74.4 94.2,74.4 94.2,77.3 95.1,77.3 95.1,74.5 95.8,74.5 95.8,73.6 99.9,73.6 99.9,71.3 94.4,71.3 94.4,70.2 93.8,70.2 93.8,70.9 91.3,70.9 91.3,70.2 90.4,70.2 90.4,72.7 91,72.7 91,74.4 90.2,74.4 90.2,75.2 87.7,75.2 87.7,78.3 84,78.3 84,80.1 79.1,80.1 79.1,79 71.5,79 71.5,74.9 67.7,74.9 67.7,73.3 63.6,73.3 63.6,71.6 56.5,71.6 56.5,70.1 55.8,70.1 55.8,71.2 54.1,71.2 54.1,70 53.38,70 53.38,74.4 52.59,74.4 52.59,75.2 51,75.2 51,78.3 43.9,78.3 43.9,80 42.3,80
AIC3204I2C_ENN  (via drill 0.15 pad 0.45)
  Top 0.125: v63.3,80.8 63.58,80.8 63.75,80.62 63.75,70.38 v66.12,68
  Top 0.305: U18.19 74,53.56 74,52.3 v73.8,52.1 | U4.J2 v61,80.4
  Route3 0.1: v63.3,80.8 61.4,80.8
  Route3 0.125: 61.4,80.8 v61,80.4
  Bottom 0.125: v66.12,68 68.25,68 74.88,61.38 74.88,56.12 75.5,55.5 75.5,51.62 75,51.12 74,51.12 73.8,51.33 v73.8,52.1
  Bottom 0.305: v73.8,52.1 73.53,52.37 R136.2
AIC_IISCLK  (via drill 0.15 pad 0.45)
  Top 0.125: U17.2 58.15,55.85 v58.6,55.4
  Bottom 0.125: v58.6,55.4 59.4,54.6 R92.1
AIC_IISD0  (via drill 0.15 pad 0.45)
  Top 0.125: U17.4 58.55,56.85 v58.6,56.8
  Bottom 0.125: v58.6,56.8 58.7,56.9 R94.1
AIC_IISD1  (via drill 0.15 pad 0.45)
  Top 0.125: U17.5 58.09,57.35 58.1,57.34 v58.1,57.3
  Bottom 0.125: R95.1 59.6,58.1 58.8,57.3 v58.1,57.3
AIC_IISFS  (via drill 0.15 pad 0.45)
  Top 0.125: U17.3 58.27,56.34 58.91,55.7 v59.2,55.7
  Bottom 0.125: v59.2,55.7 R93.1
AIC_LINE2L  (via drill 0.15 pad 0.45)
  Top 0.125: v47.2,61.4 C17.1 | R175.2 105.1,32.71 v105.1,34.5
  Route3 0.1: v60.3,34 73.5,34 74,34.5 88.6,34.5 89.3,33.8 98.1,33.8 98.5,33.4 104,33.4 v105.1,34.5
  Bottom 0.125: v60.3,34 59.1,34 56.3,36.8 56.3,37.1 46,47.4 46,60.2 v47.2,61.4 R110.1
AIC_LINE2R  (via drill 0.15 pad 0.45)
  Top 0.125: R197.2 103.4,32.68 v103.4,34.5
  Top 0.305: v47.2,59.9 C16.1
  Route3 0.1: v60,35.4 60.1,35.3 73.2,35.3 73.5,35 76.1,35 76.4,35.3 101.8,35.3 102.6,34.5 v103.4,34.5
  Bottom 0.125: R111.2 47.4,59.2 46.8,58.6 46.8,52.2 60,39 v60,35.4
  Bottom 0.305: R111.2 47.75,59.9 v47.2,59.9
AIC_MCLK  (via drill 0.15 pad 0.45)
  Top 0.125: 57.2,55.34 U17.1 57.71,55.35 58.26,54.8 59.7,54.8 61.7,52.8 65.6,52.8 66.1,52.3 v68.2,52.3
  Top 0.305: v68.2,52.3 68.78,52.88 U18.11
  Bottom 0.305: R138.2 68.2,52.98 v68.2,52.3
AIC_MODE_SEL  (via drill 0.15 pad 0.45)
  Top 0.125: U17.12 54.99,59.59 R104.2 55.01,60.39 v55,60.5
  Bottom 0.125: v55,60.5 R104.2
AIC_RST  (via drill 0.15 pad 0.45)
  Top 0.125: R8.1 56.86,53.04 v56.8,53.1 56.6,53.1 56.3,53.4 56.3,53.71 55.93,54.08 55.93,54.6 U17.31
  Bottom 0.125: v56.8,53.1 56.85,53.15 R137.1 R141.1
ANA_LDO_OUT  (via drill 0.15 pad 0.45)
  Top 0.305: U4.B9 v54.6,74 | U4.C7 v57,74.8 | U4.B7 v57,74
  Bottom 0.125: C85.1 56.7,72.6 56.5,72.8 56.5,73.5 v57,74
  Bottom 0.305: C73.1 v57,74.8 | C86.1 v55.61,72.57
  pour Route5 (isolate 0.1, rank 2): 54.3,75.1 57.3,75.1 57.3,68.6 54.3,68.6
  pour Route4 (isolate 0.1, rank 2): 54.3,75.1 57.4,75.1 57.4,68.6 54.3,68.6
ANA_LDO_OUT2  (via drill 0.15 pad 0.45)
  Top 0.305: U5.B9 v92.2,74 | U5.C7 v94.6,74.8 | U5.B7 v94.6,74 | J7.14 v127.4,52.1
  Route3 0.305: v93.5,72.6 94.4,71.7 101.9,71.7 102.1,71.5 v124.8,71.5
  Bottom 0.125: v94.6,74 94.2,73.6 94.2,72.7 94.5,72.4 C85-2.1
  Bottom 0.305: C73-2.1 v94.6,74.8 | C85-2.1 C86-2.1 v93.5,72.6 | v124.8,71.5 124.9,71.4 124.9,63 125.7,62.2 125.7,59.9 124.9,59.1 124.9,52.5 125.3,52.1 v127.4,52.1
  pour Route5 (isolate 0.1): 91.8,75.2 94.9,75.2 94.9,69.6 91.8,69.6
  pour Route4 (isolate 0.1): 91.8,75.2 94.9,75.2 94.9,69.6 91.8,69.6
BAT+
  Top 0.635: JP1.2 125.09,12.89 122.6,10.4 J8.2
BAT-
  Top 0.635: JP1.1 116.45,17.65 114.1,15.3 114.1,13.53 J8.1 114.59,13.51 114.7,13.4 112.9,13.4 109.9,10.4 88.17,10.4 J3.R J3.RN
C2-CENTER  (via drill 0.15 pad 0.45)
  Top 0.125: J5.12 37.56,53.4 v39.6,53.4
  Top 0.305: U5.N7 v94.6,83.6
  Route3 0.1: v40.2,47.5 59.7,47.5 60.7,48.5 104,48.5 v104.1,48.6
  Route4 0.1: v104.8,87.4 104.8,51.1 104.1,50.4 v104.1,48.6 | v40.2,47.5 40.2,52.8 v39.6,53.4
  Bottom 0.125: v94.6,83.6 94.1,84.1 94.1,85.1 94.3,85.3 R83X.1 93.9,86.4 93.7,86.6 93.7,87.8 94.6,88.7 103.5,88.7 v104.8,87.4
C2-DOWN  (via drill 0.15 pad 0.45)
  Top 0.125: J5.8 v42.2,55.9
  Top 0.305: U5.P3 v97.8,84.4
  Route3 0.1: v99.2,51.4 98.8,51.8 78.1,51.8 76.7,50.4 59.6,50.4 59.3,50.1 58.4,50.1 58.1,50.4 v42.2,50.4
  Route4 0.1: v101.5,85.3 101.5,72.9 101.2,72.6 101.2,59.2 100.5,58.5 100.5,54.6 99.8,53.9 99.8,52 v99.2,51.4 | v42.2,50.4 v42.2,55.9
  Bottom 0.125: v97.8,84.4 98.6,85.2 101.4,85.2 v101.5,85.3
C2-LEFT  (via drill 0.15 pad 0.45)
  Top 0.125: J5.20 37.54,48.3 v39.6,48.3
  Top 0.305: U5.N5 v96.2,83.6
  Route3 0.1: v96.2,83.6 96.6,84 v105.4,84 | v105.3,48.3 105.2,48.2 61.1,48.2 59.9,47 39.9,47 39.6,47.3 v39.6,48.3
  Route4 0.1: v105.4,84 105.3,83.9 v105.3,48.3
C2-RIGHT  (via drill 0.15 pad 0.45)
  Top 0.125: J5.4 37.58,58.5 v41.8,58.5
  Top 0.305: U5.P8 v93,84.4
  Route3 0.1: 92.3,85.1 v93,84.4 92,85.4 91.2,85.4 90.9,85.1 90,85.1 89.7,85.4 81.7,85.4 81.2,84.9 v76,84.9 | v77.1,52.2 76.2,51.3 v41.8,51.3
  Route4 0.1: v76,84.9 76,70.1 77.1,69 v77.1,52.2 | v41.8,51.3 v41.8,58.5
C2-UP  (via drill 0.15 pad 0.45)
  Top 0.125: J5.16 37.55,50.8 v39.6,50.8
  Top 0.305: U5.P2 v98.6,84.4
  Route3 0.1: v99.2,52.1 77.9,52.1 76.7,50.9 39.7,50.9 v39.6,50.8
  Route4 0.1: v101,84.8 101,72.9 100.8,72.7 100.8,59.4 99.4,58 99.4,52.3 v99.2,52.1
  Bottom 0.125: v98.6,84.4 99,84.8 v101,84.8
CLEAN  (via drill 0.15 pad 0.45)
  Top 0.305: U5.M8 v93,82.8 | Q10.B 101,32.98 v101,34.2
  Route4 0.1: v93,82.8 93.8,82 93.8,73.3 94.5,72.6 94.5,55.5
  Route4 0.125: 94.5,55.5 96.9,53.1 96.9,42.8 101,38.7 v101,34.2
CLEAN_C
  Top 0.125: U20.7 100.25,23.73 R172.2 97.72,23.66 C188.1 94.3,23.7 93,23.7 92.6,24.1 81,24.1 78.9,22 75,22 72.87,24.13 C207.1
CLEAN_S  (via drill 0.15 pad 0.45)
  Top 0.125: U13.3 94.98,27.88 v94.4,27.3 94.4,25.72 C188.2
  Bottom 0.125: R199.1 94.4,28.17 v94.4,27.3
CLK12MHZ
  Top 0.125: U14.3 73.8,91.36 73.8,90.3 73.59,90.09 U15X.1
CLK_12MHZ  (via drill 0.15 pad 0.45)
  Top 0.125: R227X.2 67.74,90.84 v66.25,89.35
  Route3 0.1: v30.3,89 35.3,89 35.8,88.5 51.8,88.5 52.5,89.2 66.1,89.2 v66.25,89.35
  Bottom 0.125: R23.1 30.3,76.05 v30.3,89
CLK_SEL  (via drill 0.15 pad 0.45)
  Top 0.305: U4.D1 v61.8,75.6
  Bottom 0.125: v61.8,75.6 62.2,75.6 62.9,76.3 66.01,76.3 R33.2
CLK_SEL2  (via drill 0.15 pad 0.45)
  Top 0.305: U5.D1 v99.4,75.6
  Bottom 0.125: R33-2.2 103.78,75.62 103.8,75.6 103.3,75.6 102.7,76.2 100,76.2 v99.4,75.6
CLKOUT2  (via drill 0.15 pad 0.45)
  Top 0.125: v98.6,73.2 98.7,73.1 TP4-2.TP
  Top 0.305: U5.A2 v98.6,73.2
  Bottom 0.125: R117-2.2 99.7,72.1 v98.6,73.2
CODEC_AVDD  (via drill 0.15 pad 0.45)
  Top 0.305: U17.24 v51.2,55.35 50.12,55.35 C19.1
  Bottom 0.305: R107.1 53,62.9 52.2,62.1 52.2,55.9 51.65,55.35 v51.2,55.35 49.85,55.35 C116.1
CODEC_DVDD  (via drill 0.15 pad 0.45)
  Top 0.125: C11.1 54.95,52.03 v54.95,52.95 54.9,52.9
  Top 0.305: C11.1 54.9,52.9 | v54.95,52.95 U17.29
  Bottom 0.125: 54.9,52.9 C108.1 54.95,51.75 v54.95,52.95
  Bottom 0.305: 53.6,61.75 R106.2 53.7,61.65 53.7,59.4 54.1,59 54.1,55.2 54.95,54.35 v54.95,52.95
CODEC_IOVDD  (via drill 0.15 pad 0.45)
  Top 0.125: U17.6 57.23,57.9
  Top 0.305: U17.6 59.46,57.86 59.7,58.1 60.88,58.1 C8.1 61.5,58.67 C105.1 R5.2 | R5.2 | R5.2 v62.4,59.3
  Bottom 0.305: C105.1 v62.4,59.3
CODEC_LDOIN  (via drill 0.15 pad 0.45)
  Top 0.125: C12.1 v52.2,53.3 53,53.3 53.45,53.76 U17.26
  Bottom 0.125: v52.2,53.3 C111.1
  Bottom 0.305: R108.1 51.15,52.1 C111.1
CONN_HP_LOUT
  Top 0.305: C14.- 58.24,31.64 54.3,27.7 54.3,15.6 56.6,13.3 59,13.3 63.1,9.2 65.53,9.2 J4.2
CONN_HP_ROUT
  Top 0.305: J4.3 54.12,12.47 51.8,14.8 51.8,29 54.2,31.4 54.2,38.42 C13.-
CPU1_LED  (via drill 0.15 pad 0.45)
  Top 0.125: DS2.A 54.09,85.71 v55.4,84.4
  Top 0.305: U4.P8 v55.4,84.4
CPU2_CLK_12MHZ  (via drill 0.15 pad 0.45)
  Top 0.125: v102.7,74.4 102.7,70.3 99.7,67.3 94.6,67.3 92.9,65.6 84,65.6 80.3,69.3 80.3,74.1 77.4,77 v72.7,77
  Bottom 0.125: R226X.2 v72.7,77
  Bottom 0.305: R38-2.1 v102.7,74.4
CPU2_LED  (via drill 0.15 pad 0.45)
  Top 0.125: D3X.A 85.39,84.6 84.6,83.81 v84.6,83.1
  Top 0.305: U5.M12 v89.8,82.8
  Bottom 0.125: v89.8,82.8 89.4,83.2 87.6,83.2 87.5,83.1 v84.6,83.1
CPU_CLK_12MHZ  (via drill 0.15 pad 0.45)
  Top 0.125: R229X.2 67.7,77.5 67.4,77.2 67.4,75.3 66.5,74.4 v64.9,74.4
  Bottom 0.125: v64.9,74.4 R38.1
DCIN
  Top 0.635: J8.3 114.09,5.79 113.6,5.3 108.2,5.3 CF1.1
DGND  (via drill 0.15 pad 0.45)
  Top 0.305: U5.P1 v99.4,84.4 | U5.M7 v94.6,82.8 | U5.K4 v97,81.2 | U5.L5 v96.2,82 | U5.K3 v97.8,81.2 | U5.H3 v97.8,79.6 | U5.P14 v88.2,84.4 | U5.K14 v88.2,81.2 | U5.L10 v91.4,82 | U5.H13 v89,79.6 | U5.J13 v89,80.4 | U5.E11 v90.6,76.4 | U5.D10 v91.4,75.6 | U5.C12 v89.8,74.8 | U5.C8 v93,74.8 | U5.B11 v90.6,74 | U5.A14 v88.2,73.2 | U5.A11 v90.6,73.2 | U5.B3 v97.8,74 | U5.B2 v98.6,74 | U5.D4 v97,75.6 | U5.D5 v96.2,75.6 | U5.E3 v97.8,76.4 | U5.E4 v97,76.4 | U5.F3 v97.8,77.2 | U4.P1 v61.8,84.4 | U4.K4 v59.4,81.2 | U4.L5 v58.6,82 | U4.K3 v60.2,81.2 | U4.H3 v60.2,79.6 | U4.M7 v57,82.8 | U4.P14 v50.6,84.4 | U4.K14 v50.6,81.2 | U4.J13 v51.4,80.4 | U4.H13 v51.4,79.6 | U4.C12 v52.2,74.8 | U4.B11 v53,74 | U4.A14 v50.6,73.2 | U4.A11 v53,73.2 | U4.C8 v55.4,74.8 | U4.E11 v53,76.4 | U4.D4 v59.4,75.6 | U4.D5 v58.6,75.6 | U4.B3 v60.2,74 | U4.B2 v61,74 | U4.E4 v59.4,76.4 | U4.E3 v60.2,76.4 | U4.F3 v60.2,77.2 | U4.L10 v53.8,82 | C5-2.2 81.5,76.8 v81.4,76.2 | v81,85.8 C1-2.2 | C4-2.2 v80.7,79.73 v80.7,79.72 | v43.8,76.1 43.8,76.6 C5.2 | Y1.NC2 52.41,69.1 v51.4,69.1 | Y1.NC1 52.41,68.2 v51.4,68.2 | Y1-2.NC2 v89,69.1 | Y1-2.NC1 v89,68.2 | U15X.4 71.62,87.37 71.63,86.47 71.63,86.33 v71.64,86.31 | U15X.7 69.67,87.38 v69.67,86.3 | C218X.2 74.9,85.57 v74.9,86.4 | U14.2 73.9,93.01 v73.9,93.8 | U9.10 70.1,62.52 v70.1,64.1 | U18.10 68.8,59.4 v68.8,58.2 | U9-2.10 108.6,61.92 v108.6,63.6 | v103.7,64.8 102.94,64.8 U10X.1 U10X.2 U10X.3 U10X.4 99.03,64.9 v98.3,64.9 | C169X.2 v97.4,63.1 | v54.4,53.6 54.45,53.65 U17.28 | C11.2 v54.9,49.3 | R9.1 v58.9,50.5 | v59,58.9 58.45,58.34 U17.7 | v28.1,74.9 28.65,74.35 U6.5 | v28.1,72.3 28.55,71.85 U6.10 | v28.1,71.1 28.35,71.35 U6.11 | v42.3,69.9 42.25,69.85 U6.35 | U6.25 35.65,68.25 v35.8,68.4 | C6.2 v43.3,73.6
  Top 0.305: TP2.TP 38.3,79.8 v38.4,79.7 38.15,79.45 U6.51 | U2.5 33.6,86.5 v33.6,85.4 | J1.GND v48.4,89.7 | U8.2 v30,61 | C21.2 v17.7,51.7 | C9.2 v17.4,56.7 | v17.7,68.5 C15.2 | C209.2 58.78,23.48 v58.8,23.5 | U24.4 63.85,21.55 v63.9,21.6 | IC2.7 79.76,29.36 v79.7,29.3 | Q4.E 84.17,27.87 v84.2,27.9 | C220.2 84.84,28.54 v84.8,28.5 | Q9.E 78.17,22.87 v78.1,22.8 | Q2.E 69.53,31.73 v69.5,31.7 | C212.2 66.87,30.73 v66.9,30.7 | R212.1 v67.09,29.21 v67.1,29.2 | C210.2 68.84,17.54 v68.9,17.6 | R209.1 68.98,20.22 v69,20.2 | Q8.E 68.23,41.47 v68.2,41.5 | C222.2 86.52,45.32 v86.5,45.3 | Q10.E 99.1,32.98 v99.1,34.2 | U13.2 94.97,29.2 v93.9,29.2 | J5.3 34.42,58.5 v32.6,58.5 | J5.7 v32.6,55.9 | J7.16 125.55,50.8 v127.4,50.8 | J7.18 125.57,49.6 v127.4,49.6 | J7.20 125.54,48.3 v127.4,48.3 | J7.19 122.46,48.3 v120.7,48.3 | C94X.2 97.7,53.48 v97.7,54.7 | U12X.1 100.3,50.97 v100.3,49.9 | v104.3,55.1 104.3,54.2 C99X.2 C21X.2 108.3,53.9 v108.3,55.1 | v115.3,55.1 C23X.2 | U1X.1 111.1,50.97 v111.1,49.9 | v105.9,43.7 U11X.2 | R126X.1 v103.6,44.3 | C26X.2 v108.2,44.2 | v43.3,79.42 C4.2 | U3X.2 62.45,70.09 62.46,70.1 62.5,70.1 v62.5,70.2 | U4.D10 v53.8,75.6 | J1-2.GND v86.4,89.9 | 60.88,56.33 C8.2 60.88,56.3 v59.5,56.3 | v71,80.4 71,81.53 U15X.12 | U6.47 42.25,75.85 v42.3,75.9 | R215.1 62.95,31.75 v63,31.7 | R216.1 v57.3,16.6 | C1.2 43.6,85.8 v43.5,85.9 | J5.19 32.69,48.28 v32.6,48.2 | C10.2 17.46,73.26 v17.4,73.2 | U6.1 30.95,76.35 v31,76.3 | U6.15 27.75,69.35 v27.5,69.3 | C6-2.2 v80.8,73.8 | 29.82,74.35 U6.5 | U6.5 | C168X.2 122.6,88.36 v122.6,87.4
  Top 0.406: J2.GND v19.38,82.1 19.38,81.08 C7.2 19.3,81.01 19.3,80.5 19.01,80.21 C92.2 19.05,79.75 19.1,79.8 v19.9,79.8 | U7.4 23.62,74.98 v23.6,75
  Top 0.61: D2.A 40.57,89.23 v40.5,89.3
  Top 0.635: J1.MTN3 J1.MTN4 45.5,89.9 44.8,89.2 42.2,89.2 | J1.MTN1 J1.MTN2 v56.2,91.5 | D2-2.A 80.1,88.98 v80.1,87.2 | J1-2.MTN3 J1-2.MTN4 83.6,91.4 v83.6,89.8 | J1-2.MTN1 J1-2.MTN2 92.4,91.4 93,90.8 v93.9,90.8 | FB2.1 81.9,52.58 v81.9,53.4
  Top 0.813: 42.2,89.2 D2.A